# EAGLE design ZMinusSunSensorBoard (EAGLE 9.6.2)
DESIGNER: T. Christison; REV#: A

## Sheet 1 of 5
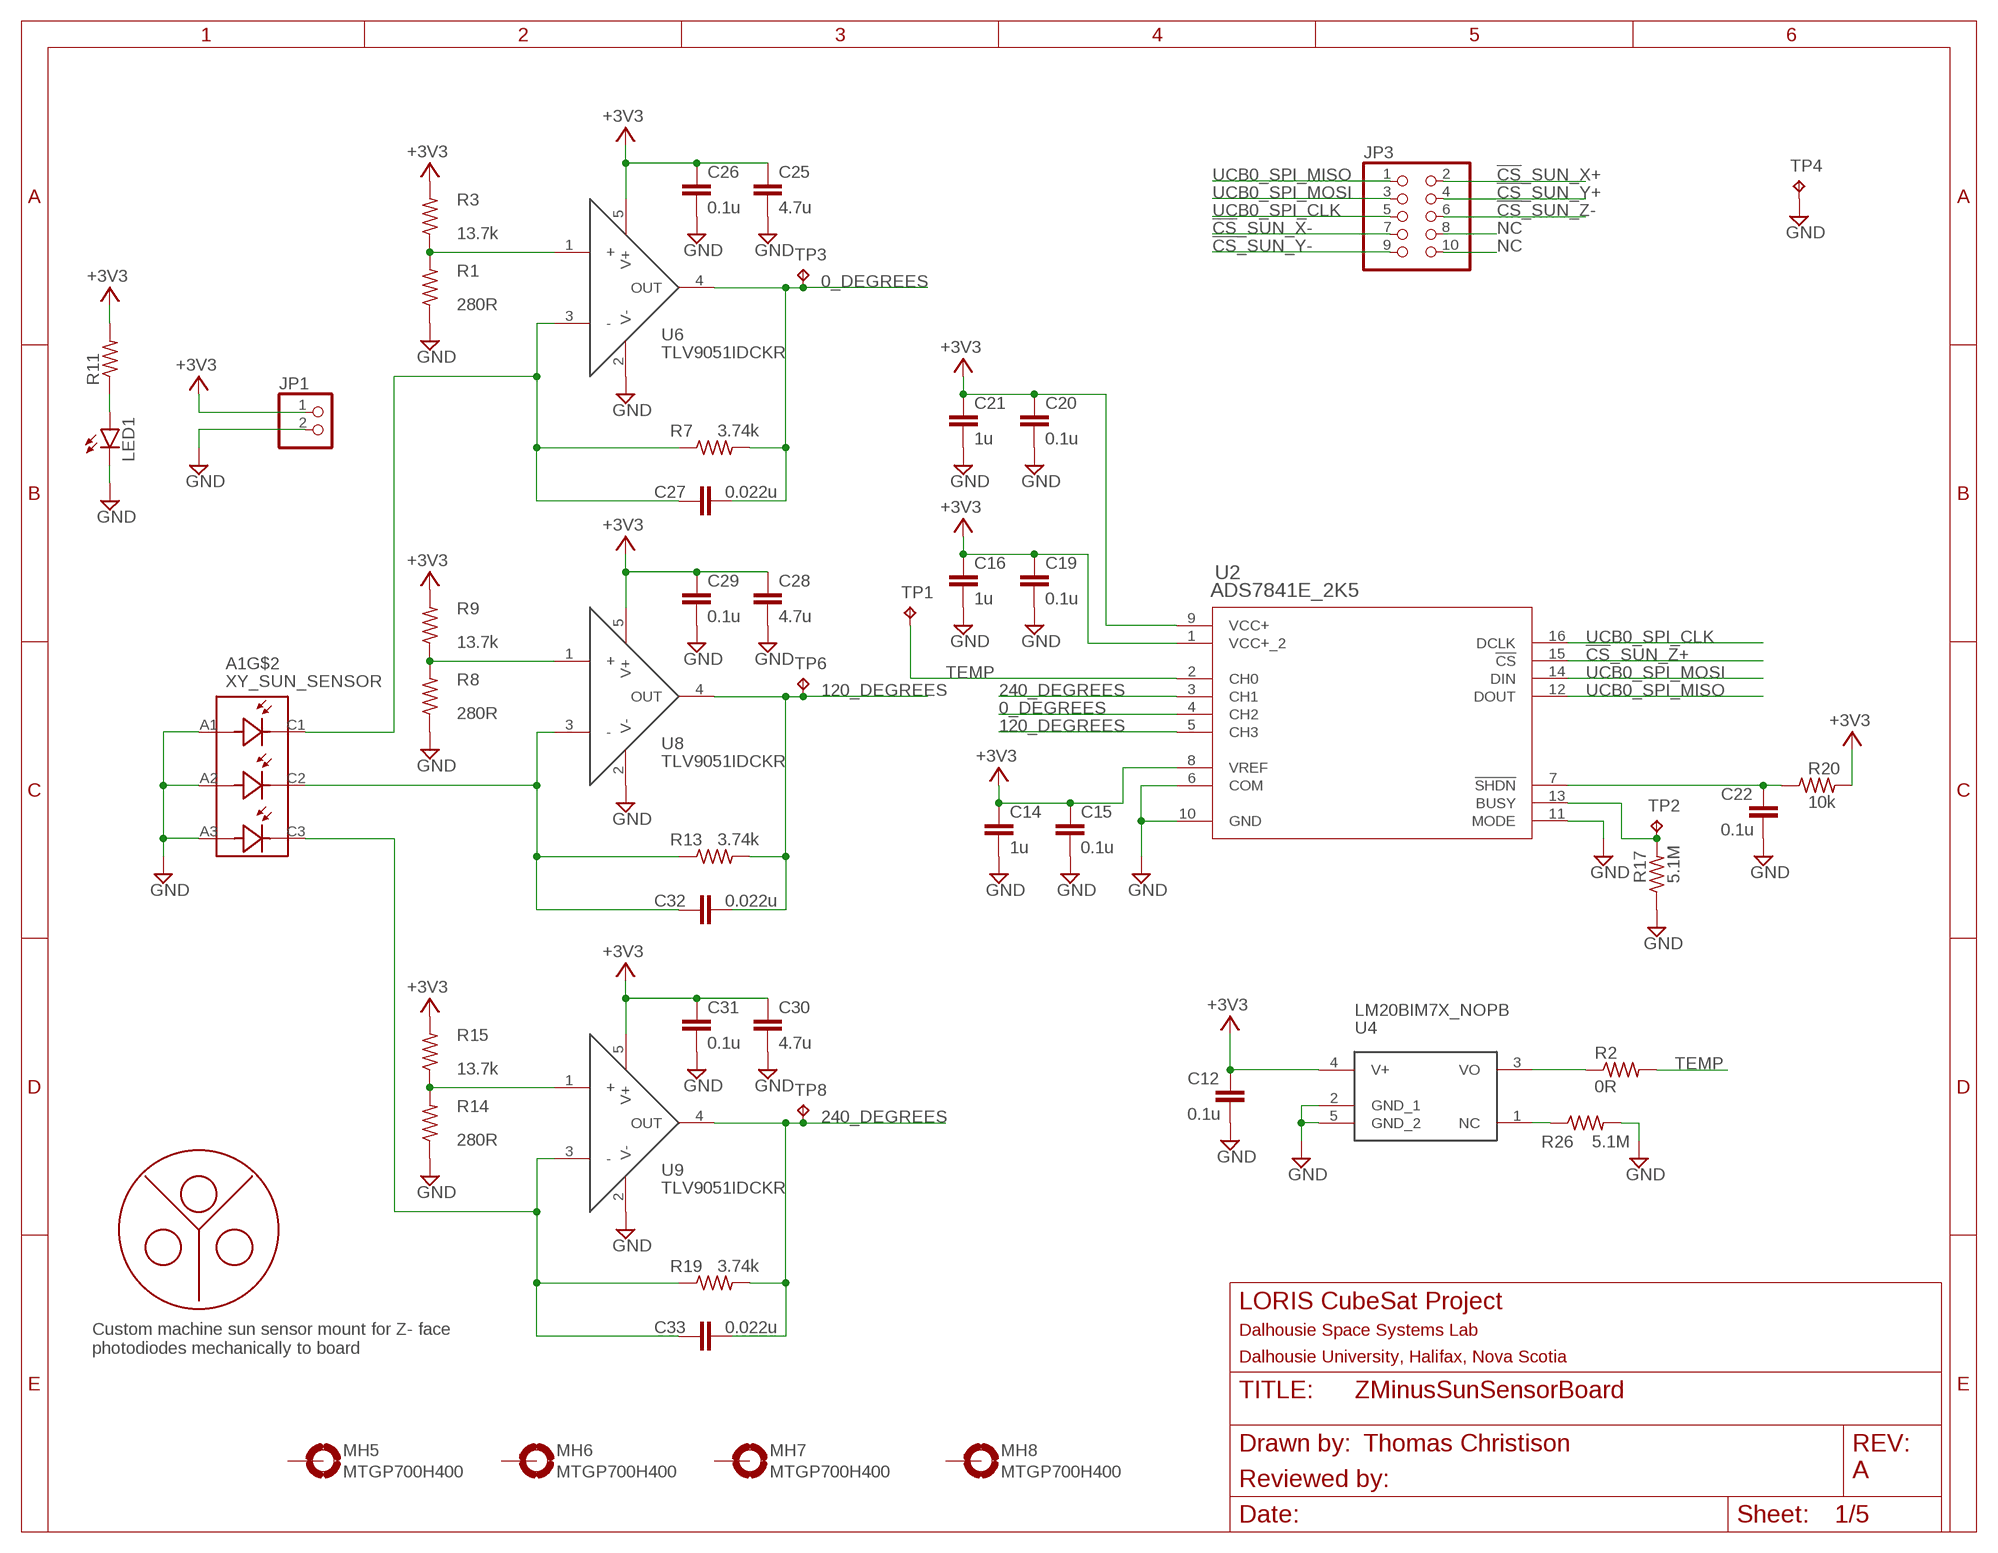
[diagram p0: schematic, sheet 1]

### Parts
A1  XY_SUN_SENSOR  [XY_SUN_SENOR_MASK]
C12  0.1u  C-EUC0402  [C0402]
C14  1u  C-EUC0402  [C0402]
C15  0.1u  C-EUC0402  [C0402]
C16  1u  C-EUC0402  [C0402]
C19  0.1u  C-EUC0402  [C0402]
C20  0.1u  C-EUC0402  [C0402]
C21  1u  C-EUC0402  [C0402]
C22  0.1u  C-EUC0402  [C0402]
C25  4.7u  C-EUC0805  [C0805]
C26  0.1u  C-EUC0402  [C0402]
C27  0.022u  C-EUC0402  [C0402]
C28  4.7u  C-EUC0805  [C0805]
C29  0.1u  C-EUC0402  [C0402]
C30  4.7u  C-EUC0805  [C0805]
C31  0.1u  C-EUC0402  [C0402]
C32  0.022u  C-EUC0402  [C0402]
C33  0.022u  C-EUC0402  [C0402]
JP1  PINHD-1X2  [1X02]
JP3  PINHD-2X5  [2X05]
LED1  LEDCHIP-LED0603  [CHIP-LED0603]
MH5  MTGP700H400  [MTGP700H400]
MH6  MTGP700H400  [MTGP700H400]
MH7  MTGP700H400  [MTGP700H400]
MH8  MTGP700H400  [MTGP700H400]
R1  280R  R-US_R0402  [R0402]
R2  0R  R-US_R0805  [R0805]
R3  13.7k  R-US_R0402  [R0402]
R7  3.74k  R-US_R0402  [R0402]
R8  280R  R-US_R0402  [R0402]
R9  13.7k  R-US_R0402  [R0402]
R11  R-US_R0603  [R0603]
R13  3.74k  R-US_R0402  [R0402]
R14  280R  R-US_R0402  [R0402]
R15  13.7k  R-US_R0402  [R0402]
R17  5.1M  R-US_R0402  [R0402]
R19  3.74k  R-US_R0402  [R0402]
R20  10k  R-US_R0402  [R0402]
R26  5.1M  R-US_R0402  [R0402]
TP1  TESTPOINT  [TP_P76H50]
TP2  TESTPOINT  [TP_P76H50]
TP3  TESTPOINT  [TP_P76H50]
TP4  TESTPOINT  [TP_P76H50]
TP6  TESTPOINT  [TP_P76H50]
TP8  TESTPOINT  [TP_P76H50]
U2  ADS7841E_2K5  [DBQ16]
U4  LM20BIM7X_NOPB  [SOT23-5P65_210X110L40X22N_LM20]
U6  TLV9051IDCKR  [SC70-5P65_210X110L36X22N_TLV9051]
U8  TLV9051IDCKR  [SC70-5P65_210X110L36X22N_TLV9051]
U9  TLV9051IDCKR  [SC70-5P65_210X110L36X22N_TLV9051]

### Nets
0_DEGREES: C27.2 R7.2 TP3.1(TP) U2.4(CH2) U6.4(OUT)
120_DEGREES: C32.2 R13.2 TP6.1(TP) U2.5(CH3) U8.4(OUT)
240_DEGREES: C33.2 R19.2 TP8.1(TP) U2.3(CH1) U9.4(OUT)
!CS!_SUN_X+: JP3.2 ; also sheet 2
!CS!_SUN_X-: JP3.7 ; also sheet 3
!CS!_SUN_Y+: JP3.4 ; also sheet 4
!CS!_SUN_Y-: JP3.9 ; also sheet 5
!CS!_SUN_Z+: U2.15(!CS)
!CS!_SUN_Z-: JP3.6
+3V3: C12.1 C14.1 C15.1 C16.1 C19.1 C20.1 C21.1 C25.1 C26.1 C28.1 C29.1 C30.1 C31.1 JP1.1 R3.2 R9.2 R11.2 R15.2 R20.2 U2.1(VCC+_2) U2.8(VREF) U2.9(VCC+) U4.4(V+) U6.5(V+) U8.5(V+) U9.5(V+) ; also sheet 2,3,4,5
GND: A1.A1 A1.A2 A1.A3 C12.2 C14.2 C15.2 C16.2 C19.2 C20.2 C21.2 C22.2 C25.2 C26.2 C28.2 C29.2 C30.2 C31.2 JP1.2 LED1.C R1.1 R8.1 R14.1 R17.1 R26.2 TP4.1(TP) U2.6(COM) U2.10(GND) U2.11(MODE) U4.2(GND_1) U4.5(GND_2) U6.2(V-) U8.2(V-) U9.2(V-) ; also sheet 2,3,4,5
N$1: R2.1 U4.3(VO)
N$2: R17.2 TP2.1(TP) U2.13(BUSY)
N$3: A1.C1 C27.1 R7.1 U6.3(-)
N$6: R1.2 R3.1 U6.1(+)
N$7: R26.1 U4.1(NC)
N$8: A1.C2 C32.1 R13.1 U8.3(-)
N$9: R8.2 R9.1 U8.1(+)
N$12: A1.C3 C33.1 R19.1 U9.3(-)
N$13: R14.2 R15.1 U9.1(+)
N$15: C22.1 R20.1 U2.7(!SHDN)
N$48: LED1.A R11.1
N$67: JP3.8
N$68: JP3.10
TEMP: R2.2 TP1.1(TP) U2.2(CH0)
UCB0_SPI_CLK: JP3.5 U2.16(DCLK) ; also sheet 2,3,4,5
UCB0_SPI_MISO: JP3.1 U2.12(DOUT) ; also sheet 2,3,4,5
UCB0_SPI_MOSI: JP3.3 U2.14(DIN) ; also sheet 2,3,4,5
Unconnected: MH5.1(MOUNT) MH6.1(MOUNT) MH7.1(MOUNT) MH8.1(MOUNT)

### Notes on the sheet
- NC
- NC
- Custom machine sun sensor mount for Z- face
  photodiodes mechanically to board
- Thomas Christison
- A

## Sheet 2 of 5
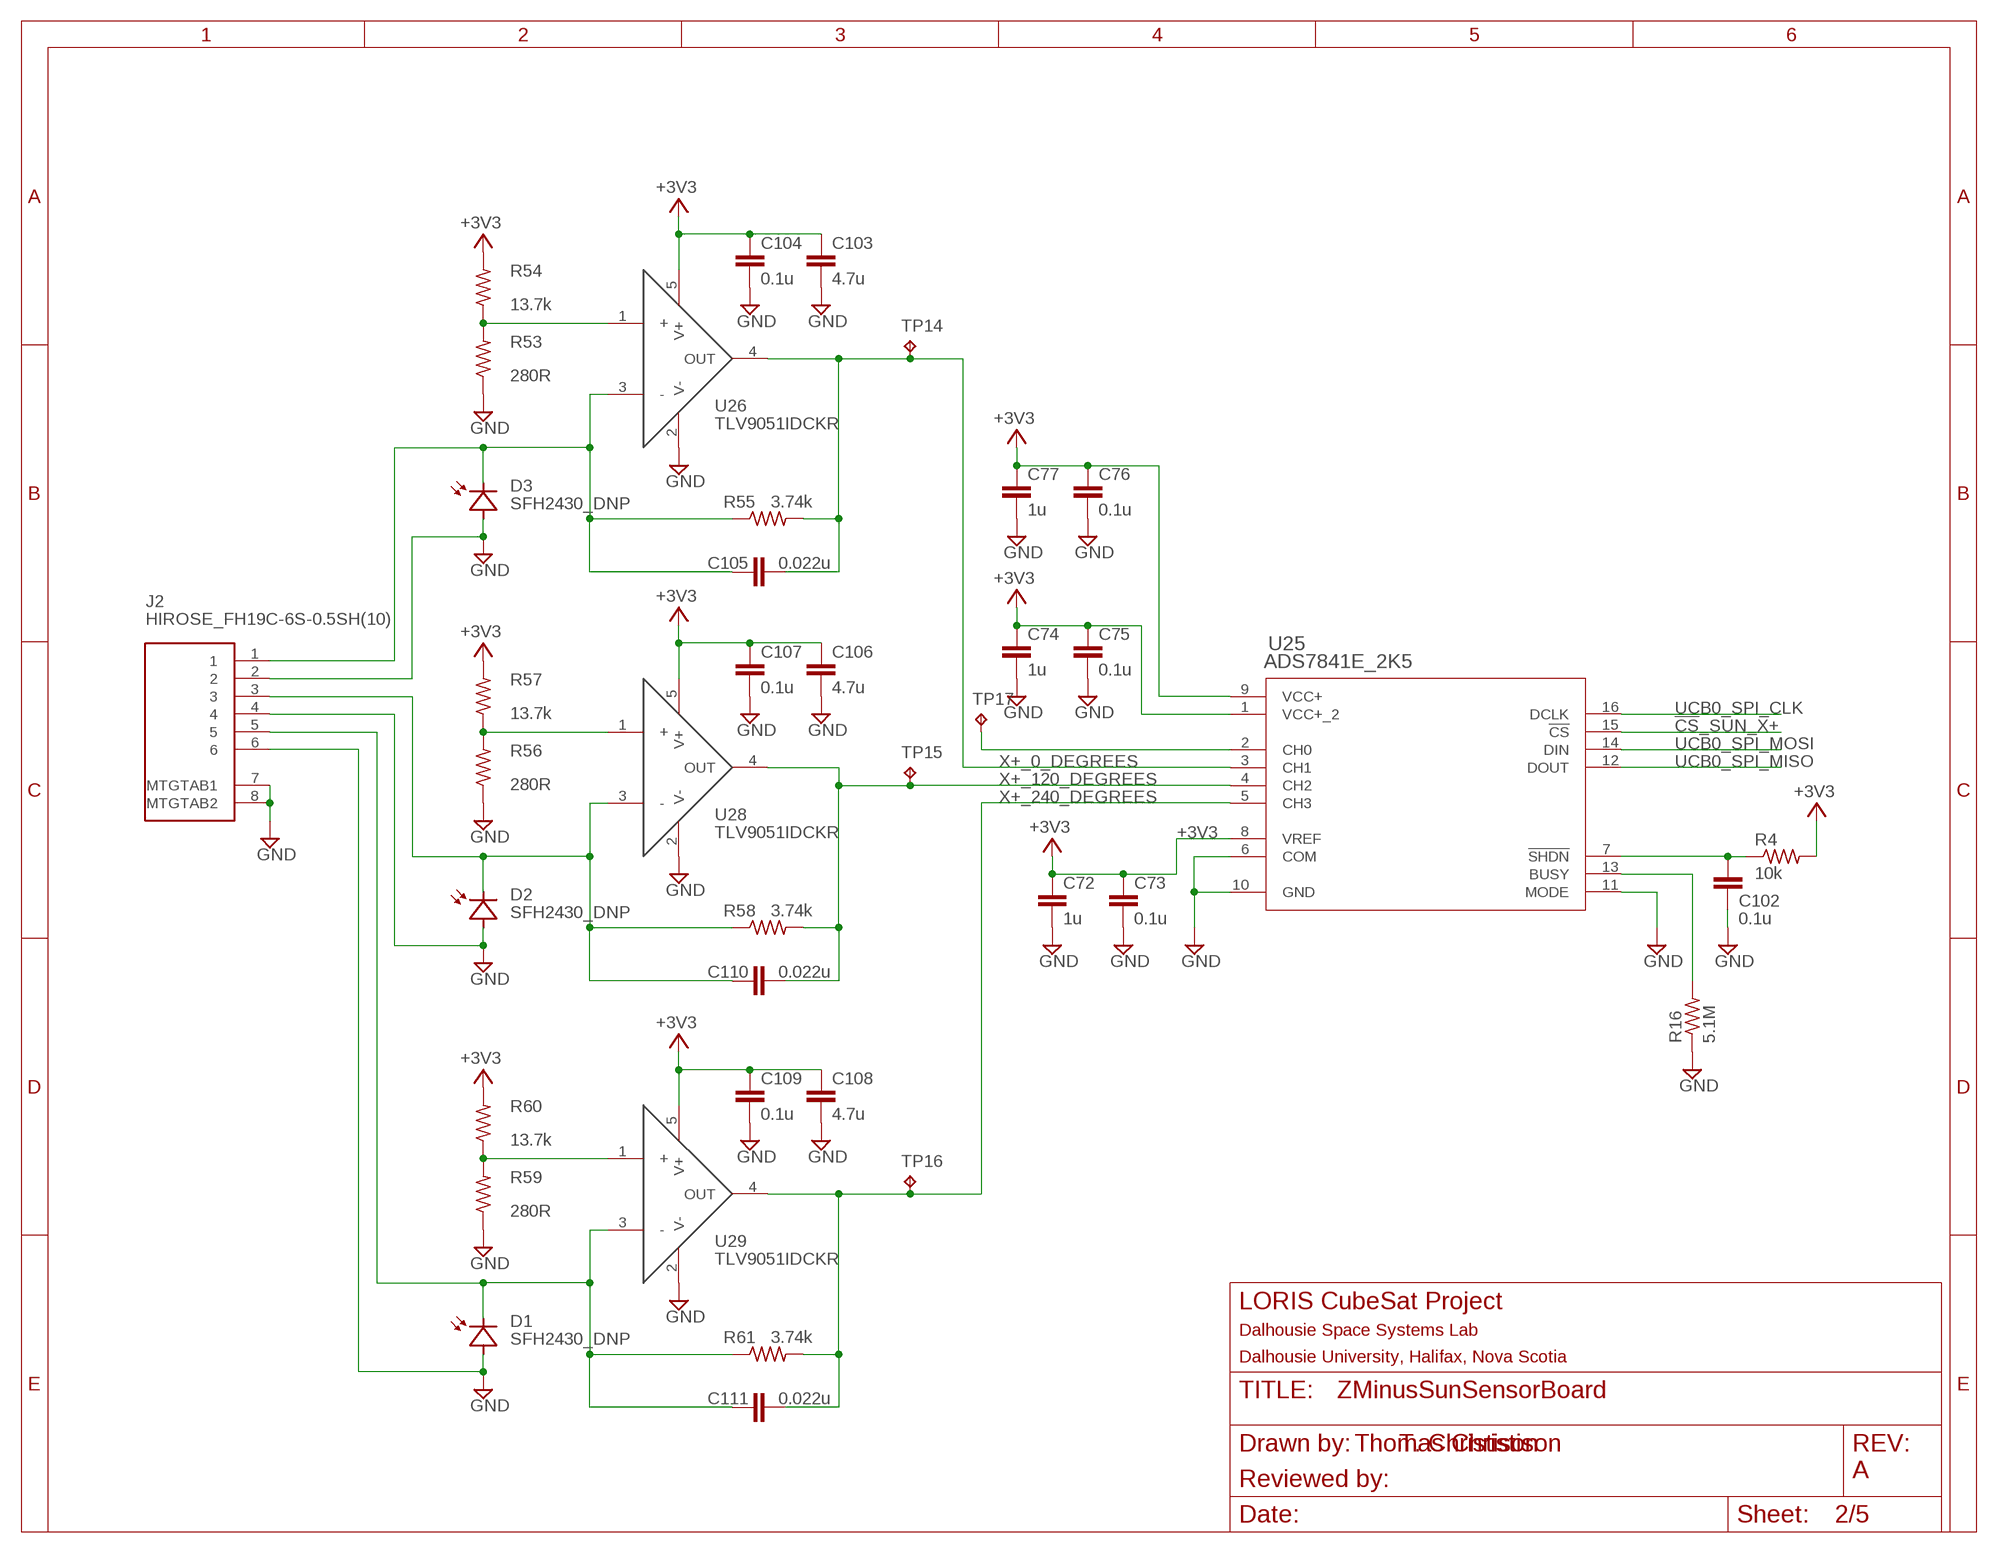
[diagram p1: schematic, sheet 2]

### Parts
C72  1u  C-EUC0402  [C0402]
C73  0.1u  C-EUC0402  [C0402]
C74  1u  C-EUC0402  [C0402]
C75  0.1u  C-EUC0402  [C0402]
C76  0.1u  C-EUC0402  [C0402]
C77  1u  C-EUC0402  [C0402]
C102  0.1u  C-EUC0402  [C0402]
C103  4.7u  C-EUC0402  [C0402]
C104  0.1u  C-EUC0402  [C0402]
C105  0.022u  C-EUC0402  [C0402]
C106  4.7u  C-EUC0402  [C0402]
C107  0.1u  C-EUC0402  [C0402]
C108  4.7u  C-EUC0402  [C0402]
C109  0.1u  C-EUC0402  [C0402]
C110  0.022u  C-EUC0402  [C0402]
C111  0.022u  C-EUC0402  [C0402]
J2  HIROSE_FH19C-6S-0.5SH(10)  [HIROSE_FH19C-6S-0.5SH(10)]
R4  10k  R-US_R0402  [R0402]
R16  5.1M  R-US_R0402  [R0402]
R53  280R  R-US_R0402  [R0402]
R54  13.7k  R-US_R0402  [R0402]
R55  3.74k  R-US_R0402  [R0402]
R56  280R  R-US_R0402  [R0402]
R57  13.7k  R-US_R0402  [R0402]
R58  3.74k  R-US_R0402  [R0402]
R59  280R  R-US_R0402  [R0402]
R60  13.7k  R-US_R0402  [R0402]
R61  3.74k  R-US_R0402  [R0402]
TP14  TESTPOINT  [TP_P76H50]
TP15  TESTPOINT  [TP_P76H50]
TP16  TESTPOINT  [TP_P76H50]
TP17  TESTPOINT  [TP_P76H50]
U25  ADS7841E_2K5  [DBQ16]
U26  TLV9051IDCKR  [SC70-5P65_210X110L36X22N_TLV9051]
U28  TLV9051IDCKR  [SC70-5P65_210X110L36X22N_TLV9051]
U29  TLV9051IDCKR  [SC70-5P65_210X110L36X22N_TLV9051]

### Nets
!CS!_SUN_X+: U25.15(!CS) ; also sheet 1
+3V3: C72.1 C73.1 C74.1 C75.1 C76.1 C77.1 C103.1 C104.1 C106.1 C107.1 C108.1 C109.1 R4.2 R54.2 R57.2 R60.2 U25.1(VCC+_2) U25.8(VREF) U25.9(VCC+) U26.5(V+) U28.5(V+) U29.5(V+) ; also sheet 1,3,4,5
GND: C72.2 C73.2 C74.2 C75.2 C76.2 C77.2 C102.2 C103.2 C104.2 C106.2 C107.2 C108.2 C109.2 J2.2 J2.4 J2.6 J2.7(MTGTAB1) J2.8(MTGTAB2) R16.1 R53.1 R56.1 R59.1 U25.6(COM) U25.10(GND) U25.11(MODE) U26.2(V-) U28.2(V-) U29.2(V-) ; also sheet 1,3,4,5
N$4: C102.1 R4.1 U25.7(!SHDN)
N$5: TP17.1(TP) U25.2(CH0)
N$49: C105.1 J2.1 R55.1 U26.3(-)
N$51: R16.2 U25.13(BUSY)
N$54: R53.2 R54.1 U26.1(+)
N$55: C110.1 J2.3 R58.1 U28.3(-)
N$56: R56.2 R57.1 U28.1(+)
N$57: C111.1 J2.5 R61.1 U29.3(-)
N$58: R59.2 R60.1 U29.1(+)
UCB0_SPI_CLK: U25.16(DCLK) ; also sheet 1,3,4,5
UCB0_SPI_MISO: U25.12(DOUT) ; also sheet 1,3,4,5
UCB0_SPI_MOSI: U25.14(DIN) ; also sheet 1,3,4,5
X+_0_DEGREES: C105.2 R55.2 TP14.1(TP) U25.3(CH1) U26.4(OUT)
X+_120_DEGREES: C110.2 R58.2 TP15.1(TP) U25.4(CH2) U28.4(OUT)
X+_240_DEGREES: C111.2 R61.2 TP16.1(TP) U25.5(CH3) U29.4(OUT)

### Notes on the sheet
- Thomas Christison
- A

## Sheet 3 of 5
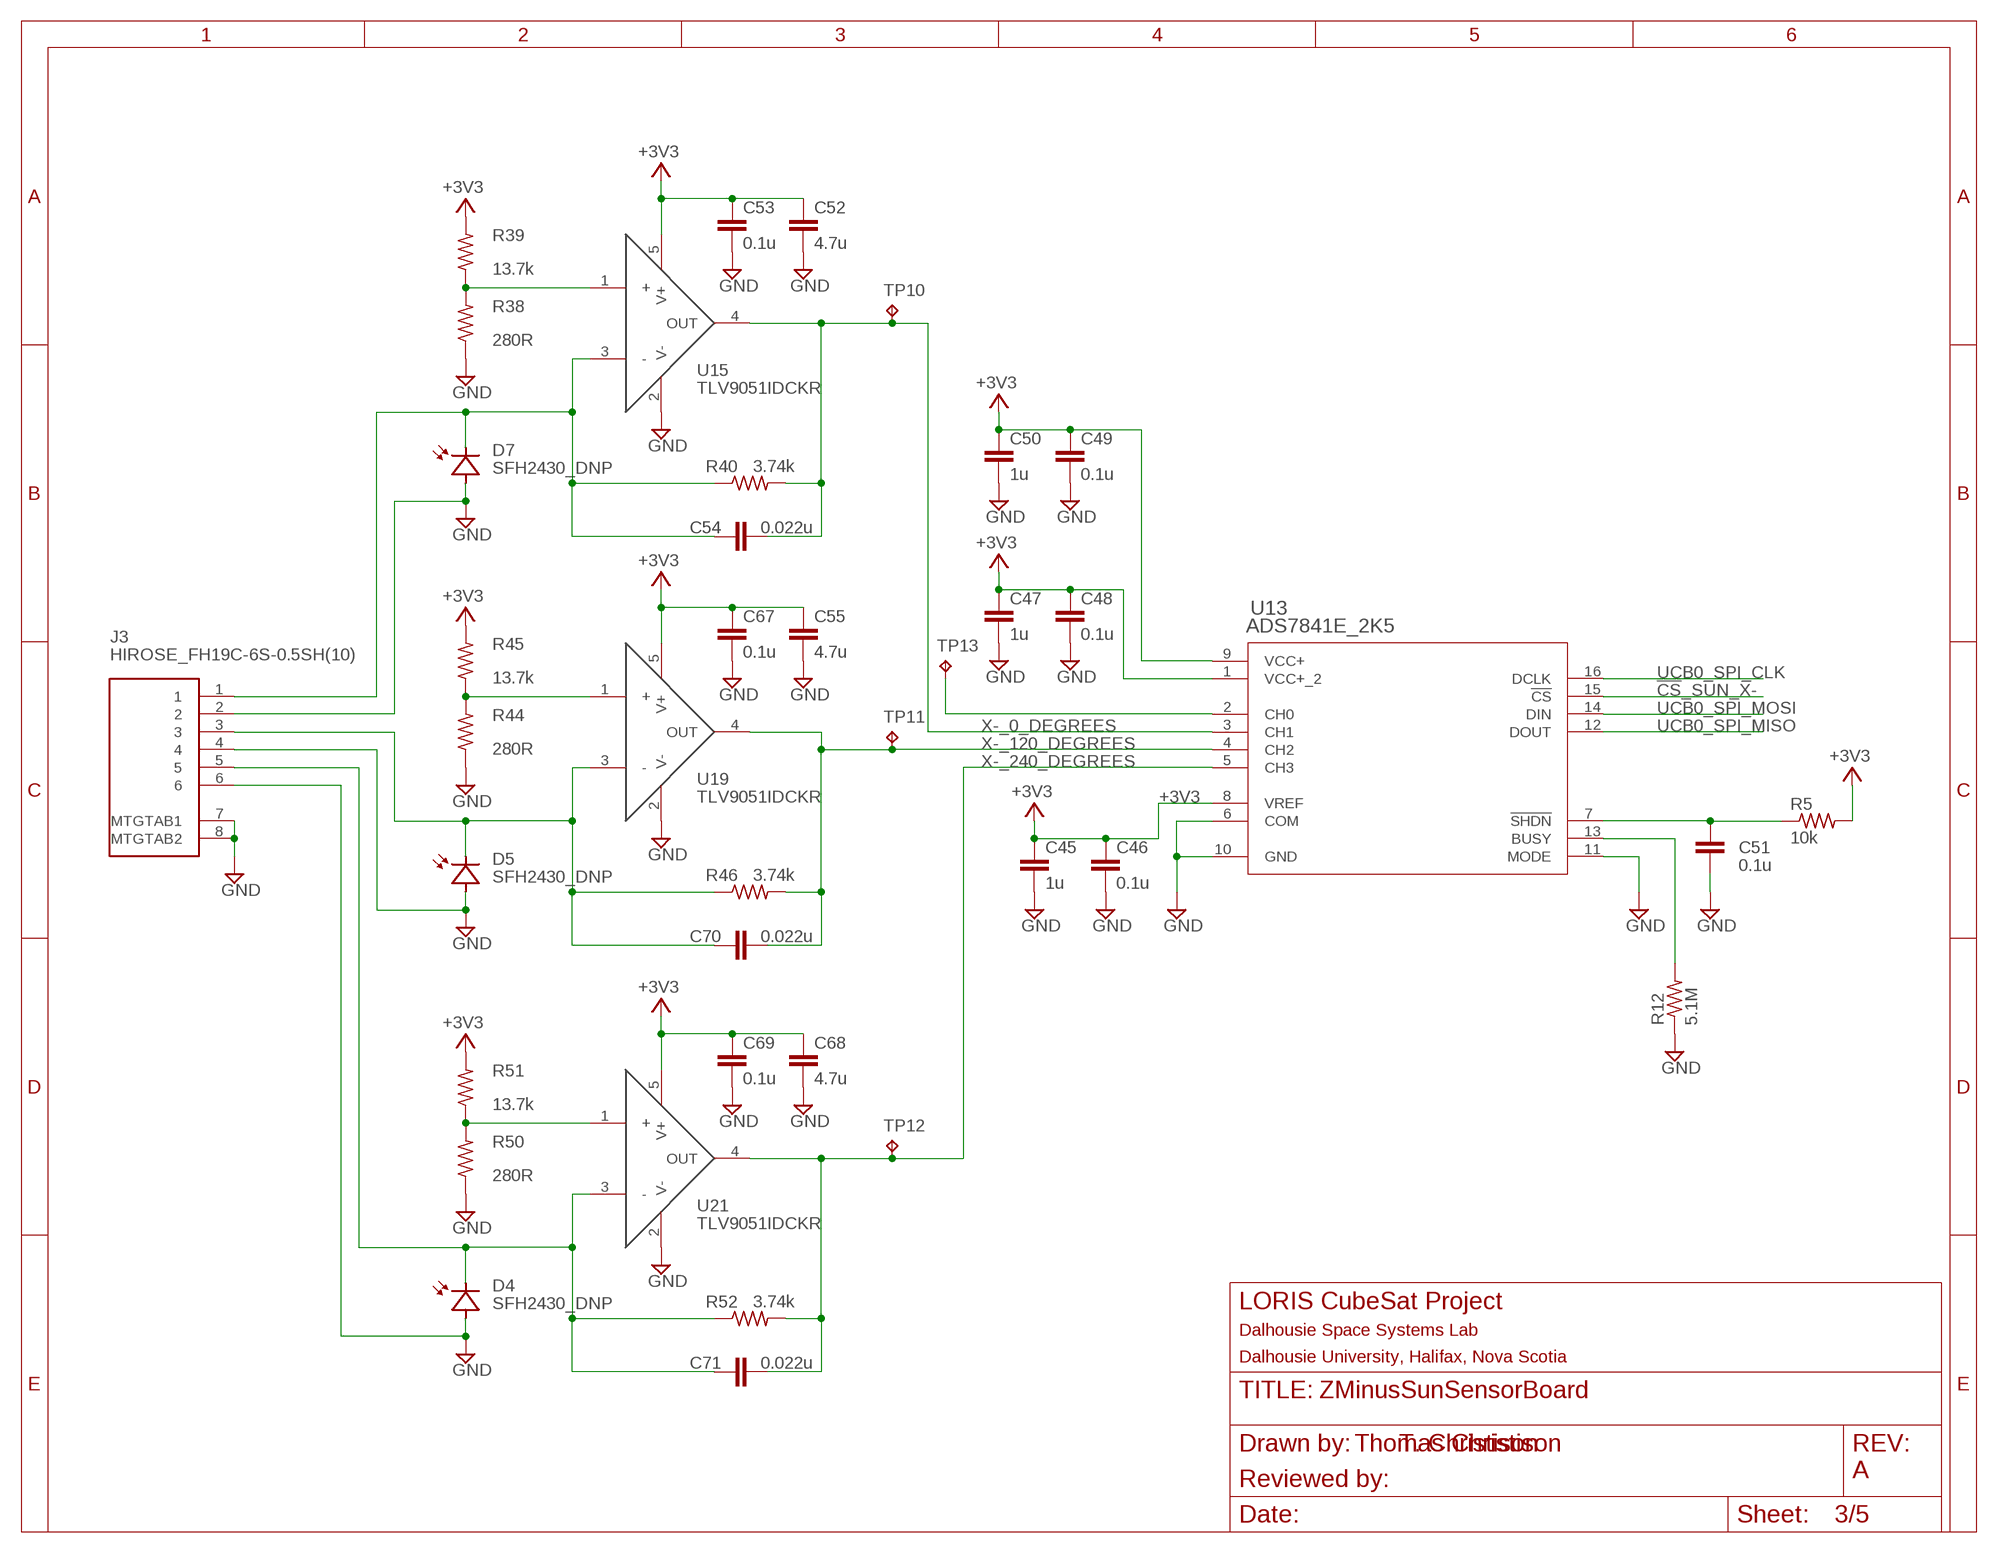
[diagram p2: schematic, sheet 3]

### Parts
C45  1u  C-EUC0402  [C0402]
C46  0.1u  C-EUC0402  [C0402]
C47  1u  C-EUC0402  [C0402]
C48  0.1u  C-EUC0402  [C0402]
C49  0.1u  C-EUC0402  [C0402]
C50  1u  C-EUC0402  [C0402]
C51  0.1u  C-EUC0402  [C0402]
C52  4.7u  C-EUC0402  [C0402]
C53  0.1u  C-EUC0402  [C0402]
C54  0.022u  C-EUC0402  [C0402]
C55  4.7u  C-EUC0402  [C0402]
C67  0.1u  C-EUC0402  [C0402]
C68  4.7u  C-EUC0402  [C0402]
C69  0.1u  C-EUC0402  [C0402]
C70  0.022u  C-EUC0402  [C0402]
C71  0.022u  C-EUC0402  [C0402]
J3  HIROSE_FH19C-6S-0.5SH(10)  [HIROSE_FH19C-6S-0.5SH(10)]
R5  10k  R-US_R0402  [R0402]
R12  5.1M  R-US_R0402  [R0402]
R38  280R  R-US_R0402  [R0402]
R39  13.7k  R-US_R0402  [R0402]
R40  3.74k  R-US_R0402  [R0402]
R44  280R  R-US_R0402  [R0402]
R45  13.7k  R-US_R0402  [R0402]
R46  3.74k  R-US_R0402  [R0402]
R50  280R  R-US_R0402  [R0402]
R51  13.7k  R-US_R0402  [R0402]
R52  3.74k  R-US_R0402  [R0402]
TP10  TESTPOINT  [TP_P76H50]
TP11  TESTPOINT  [TP_P76H50]
TP12  TESTPOINT  [TP_P76H50]
TP13  TESTPOINT  [TP_P76H50]
U13  ADS7841E_2K5  [DBQ16]
U15  TLV9051IDCKR  [SC70-5P65_210X110L36X22N_TLV9051]
U19  TLV9051IDCKR  [SC70-5P65_210X110L36X22N_TLV9051]
U21  TLV9051IDCKR  [SC70-5P65_210X110L36X22N_TLV9051]

### Nets
!CS!_SUN_X-: U13.15(!CS) ; also sheet 1
+3V3: C45.1 C46.1 C47.1 C48.1 C49.1 C50.1 C52.1 C53.1 C55.1 C67.1 C68.1 C69.1 R5.2 R39.2 R45.2 R51.2 U13.1(VCC+_2) U13.8(VREF) U13.9(VCC+) U15.5(V+) U19.5(V+) U21.5(V+) ; also sheet 1,2,4,5
GND: C45.2 C46.2 C47.2 C48.2 C49.2 C50.2 C51.2 C52.2 C53.2 C55.2 C67.2 C68.2 C69.2 J3.2 J3.4 J3.6 J3.7(MTGTAB1) J3.8(MTGTAB2) R12.1 R38.1 R44.1 R50.1 U13.6(COM) U13.10(GND) U13.11(MODE) U15.2(V-) U19.2(V-) U21.2(V-) ; also sheet 1,2,4,5
N$10: TP13.1(TP) U13.2(CH0)
N$22: C51.1 R5.1 U13.7(!SHDN)
N$38: C54.1 J3.1 R40.1 U15.3(-)
N$41: R38.2 R39.1 U15.1(+)
N$44: C70.1 J3.3 R46.1 U19.3(-)
N$45: R44.2 R45.1 U19.1(+)
N$46: C71.1 J3.5 R52.1 U21.3(-)
N$47: R50.2 R51.1 U21.1(+)
N$50: R12.2 U13.13(BUSY)
UCB0_SPI_CLK: U13.16(DCLK) ; also sheet 1,2,4,5
UCB0_SPI_MISO: U13.12(DOUT) ; also sheet 1,2,4,5
UCB0_SPI_MOSI: U13.14(DIN) ; also sheet 1,2,4,5
X-_0_DEGREES: C54.2 R40.2 TP10.1(TP) U13.3(CH1) U15.4(OUT)
X-_120_DEGREES: C70.2 R46.2 TP11.1(TP) U13.4(CH2) U19.4(OUT)
X-_240_DEGREES: C71.2 R52.2 TP12.1(TP) U13.5(CH3) U21.4(OUT)

### Notes on the sheet
- Thomas Christison
- A

## Sheet 4 of 5
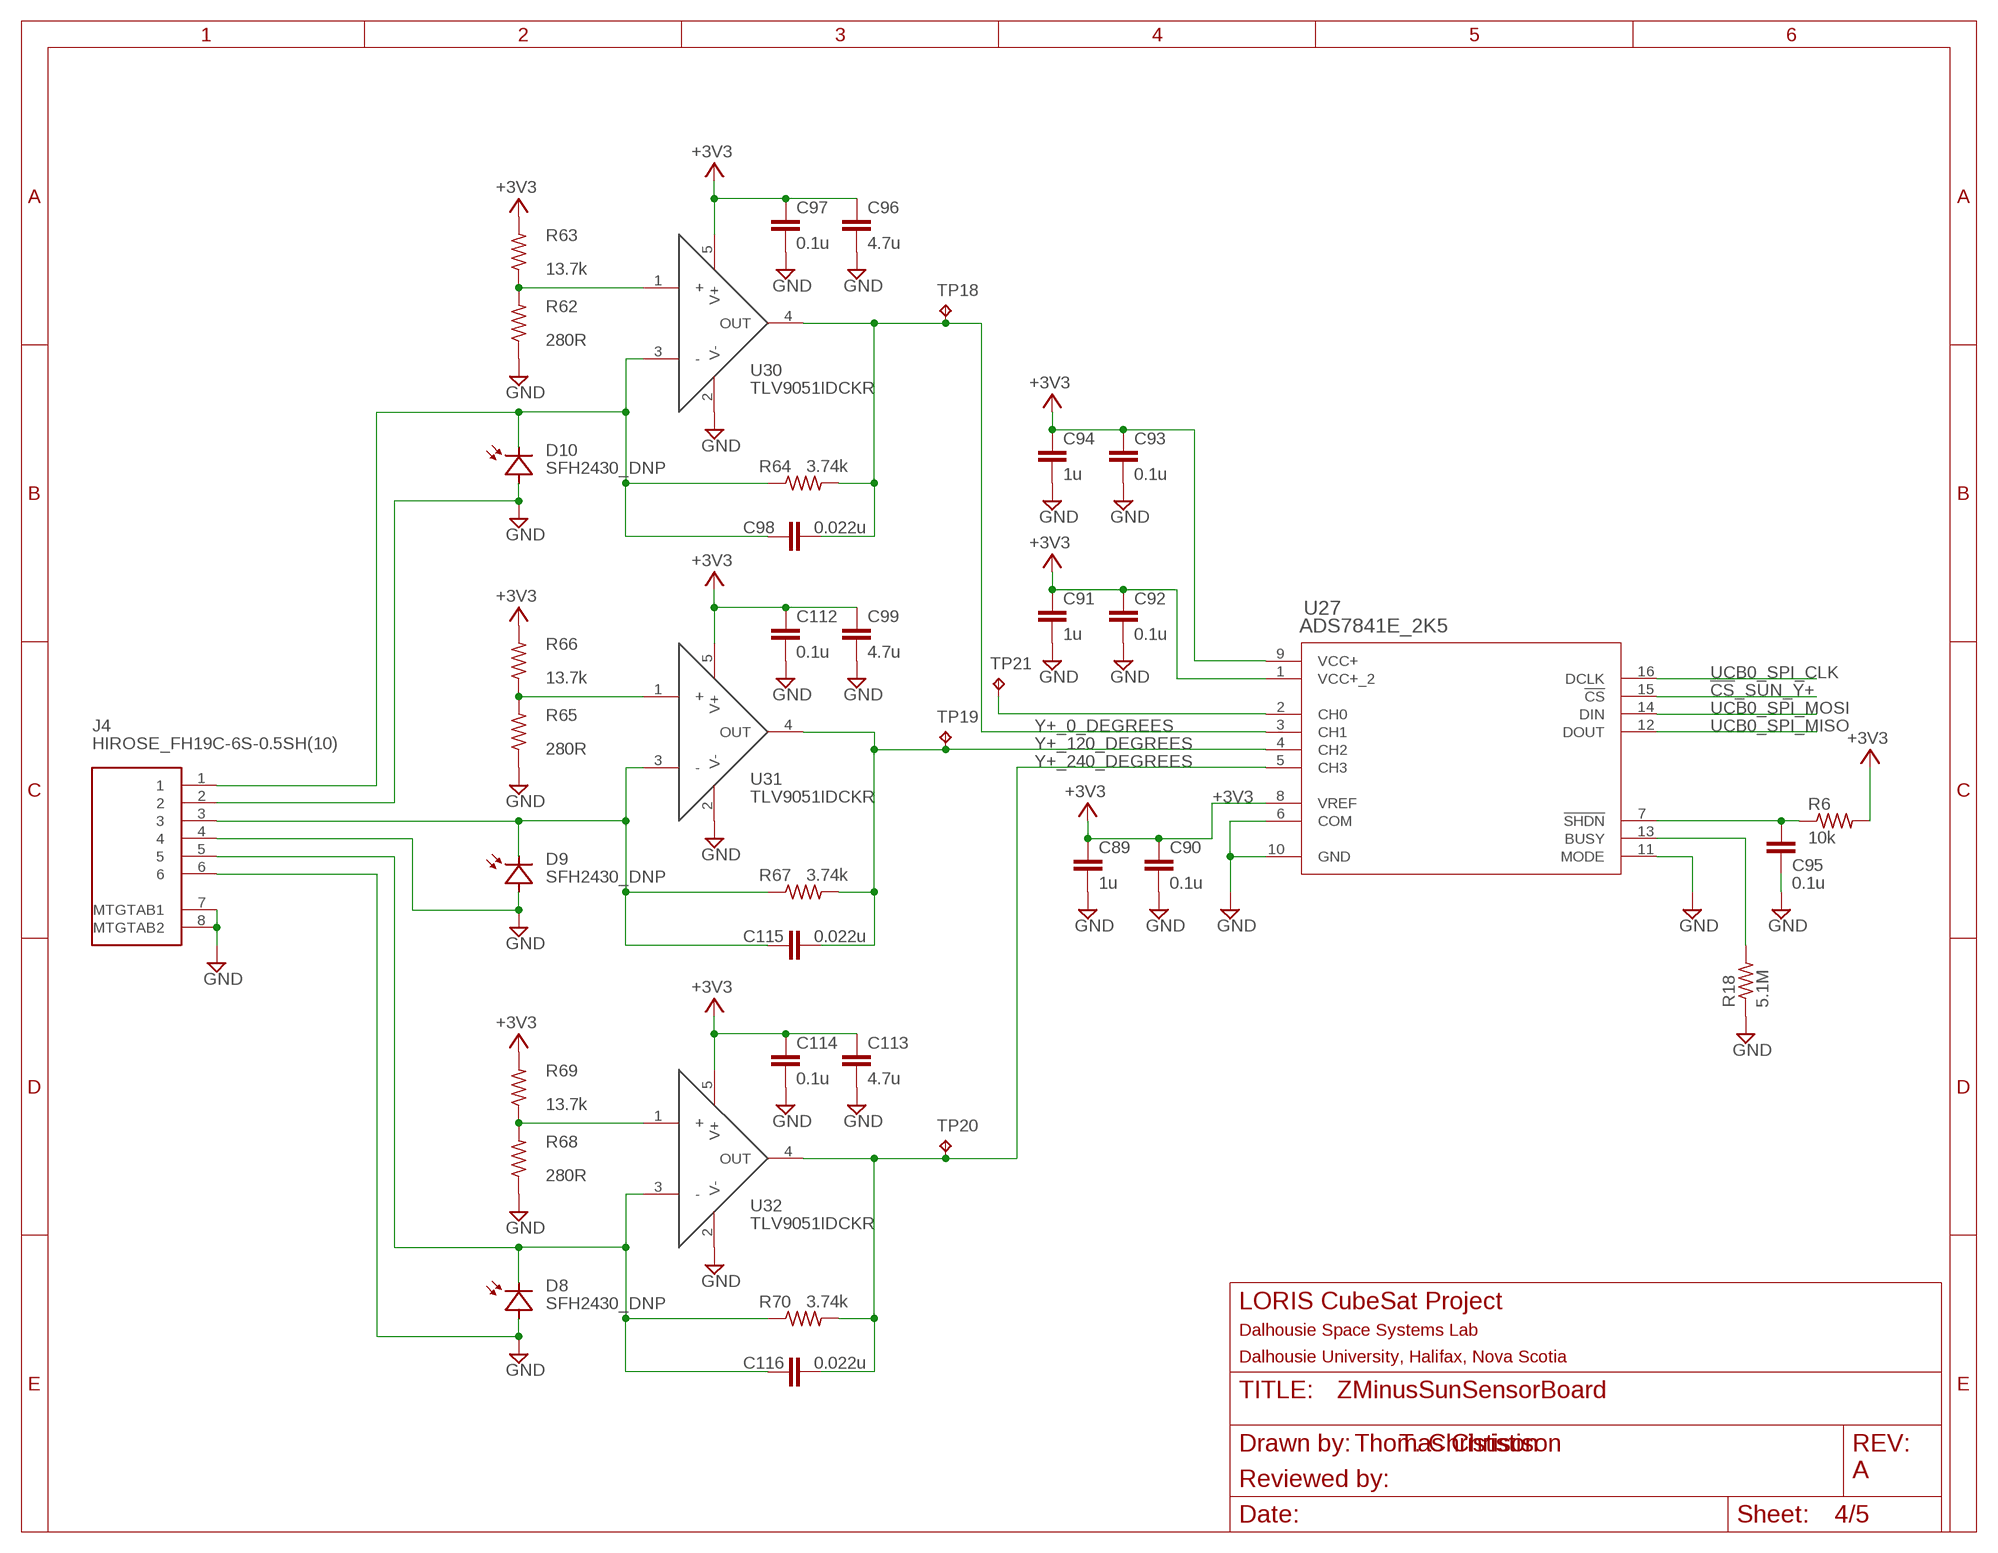
[diagram p3: schematic, sheet 4]

### Parts
C89  1u  C-EUC0402  [C0402]
C90  0.1u  C-EUC0402  [C0402]
C91  1u  C-EUC0402  [C0402]
C92  0.1u  C-EUC0402  [C0402]
C93  0.1u  C-EUC0402  [C0402]
C94  1u  C-EUC0402  [C0402]
C95  0.1u  C-EUC0402  [C0402]
C96  4.7u  C-EUC0402  [C0402]
C97  0.1u  C-EUC0402  [C0402]
C98  0.022u  C-EUC0402  [C0402]
C99  4.7u  C-EUC0402  [C0402]
C112  0.1u  C-EUC0402  [C0402]
C113  4.7u  C-EUC0402  [C0402]
C114  0.1u  C-EUC0402  [C0402]
C115  0.022u  C-EUC0402  [C0402]
C116  0.022u  C-EUC0402  [C0402]
J4  HIROSE_FH19C-6S-0.5SH(10)  [HIROSE_FH19C-6S-0.5SH(10)]
R6  10k  R-US_R0402  [R0402]
R18  5.1M  R-US_R0402  [R0402]
R62  280R  R-US_R0402  [R0402]
R63  13.7k  R-US_R0402  [R0402]
R64  3.74k  R-US_R0402  [R0402]
R65  280R  R-US_R0402  [R0402]
R66  13.7k  R-US_R0402  [R0402]
R67  3.74k  R-US_R0402  [R0402]
R68  280R  R-US_R0402  [R0402]
R69  13.7k  R-US_R0402  [R0402]
R70  3.74k  R-US_R0402  [R0402]
TP18  TESTPOINT  [TP_P76H50]
TP19  TESTPOINT  [TP_P76H50]
TP20  TESTPOINT  [TP_P76H50]
TP21  TESTPOINT  [TP_P76H50]
U27  ADS7841E_2K5  [DBQ16]
U30  TLV9051IDCKR  [SC70-5P65_210X110L36X22N_TLV9051]
U31  TLV9051IDCKR  [SC70-5P65_210X110L36X22N_TLV9051]
U32  TLV9051IDCKR  [SC70-5P65_210X110L36X22N_TLV9051]

### Nets
!CS!_SUN_Y+: U27.15(!CS) ; also sheet 1
+3V3: C89.1 C90.1 C91.1 C92.1 C93.1 C94.1 C96.1 C97.1 C99.1 C112.1 C113.1 C114.1 R6.2 R63.2 R66.2 R69.2 U27.1(VCC+_2) U27.8(VREF) U27.9(VCC+) U30.5(V+) U31.5(V+) U32.5(V+) ; also sheet 1,2,3,5
GND: C89.2 C90.2 C91.2 C92.2 C93.2 C94.2 C95.2 C96.2 C97.2 C99.2 C112.2 C113.2 C114.2 J4.2 J4.4 J4.6 J4.7(MTGTAB1) J4.8(MTGTAB2) R18.1 R62.1 R65.1 R68.1 U27.6(COM) U27.10(GND) U27.11(MODE) U30.2(V-) U31.2(V-) U32.2(V-) ; also sheet 1,2,3,5
N$11: TP21.1(TP) U27.2(CH0)
N$25: C95.1 R6.1 U27.7(!SHDN)
N$37: C98.1 J4.1 R64.1 U30.3(-)
N$52: R18.2 U27.13(BUSY)
N$61: R62.2 R63.1 U30.1(+)
N$63: C115.1 J4.3 R67.1 U31.3(-)
N$64: R65.2 R66.1 U31.1(+)
N$65: C116.1 J4.5 R70.1 U32.3(-)
N$66: R68.2 R69.1 U32.1(+)
UCB0_SPI_CLK: U27.16(DCLK) ; also sheet 1,2,3,5
UCB0_SPI_MISO: U27.12(DOUT) ; also sheet 1,2,3,5
UCB0_SPI_MOSI: U27.14(DIN) ; also sheet 1,2,3,5
Y+_0_DEGREES: C98.2 R64.2 TP18.1(TP) U27.3(CH1) U30.4(OUT)
Y+_120_DEGREES: C115.2 R67.2 TP19.1(TP) U27.4(CH2) U31.4(OUT)
Y+_240_DEGREES: C116.2 R70.2 TP20.1(TP) U27.5(CH3) U32.4(OUT)

### Notes on the sheet
- Thomas Christison
- A

## Sheet 5 of 5
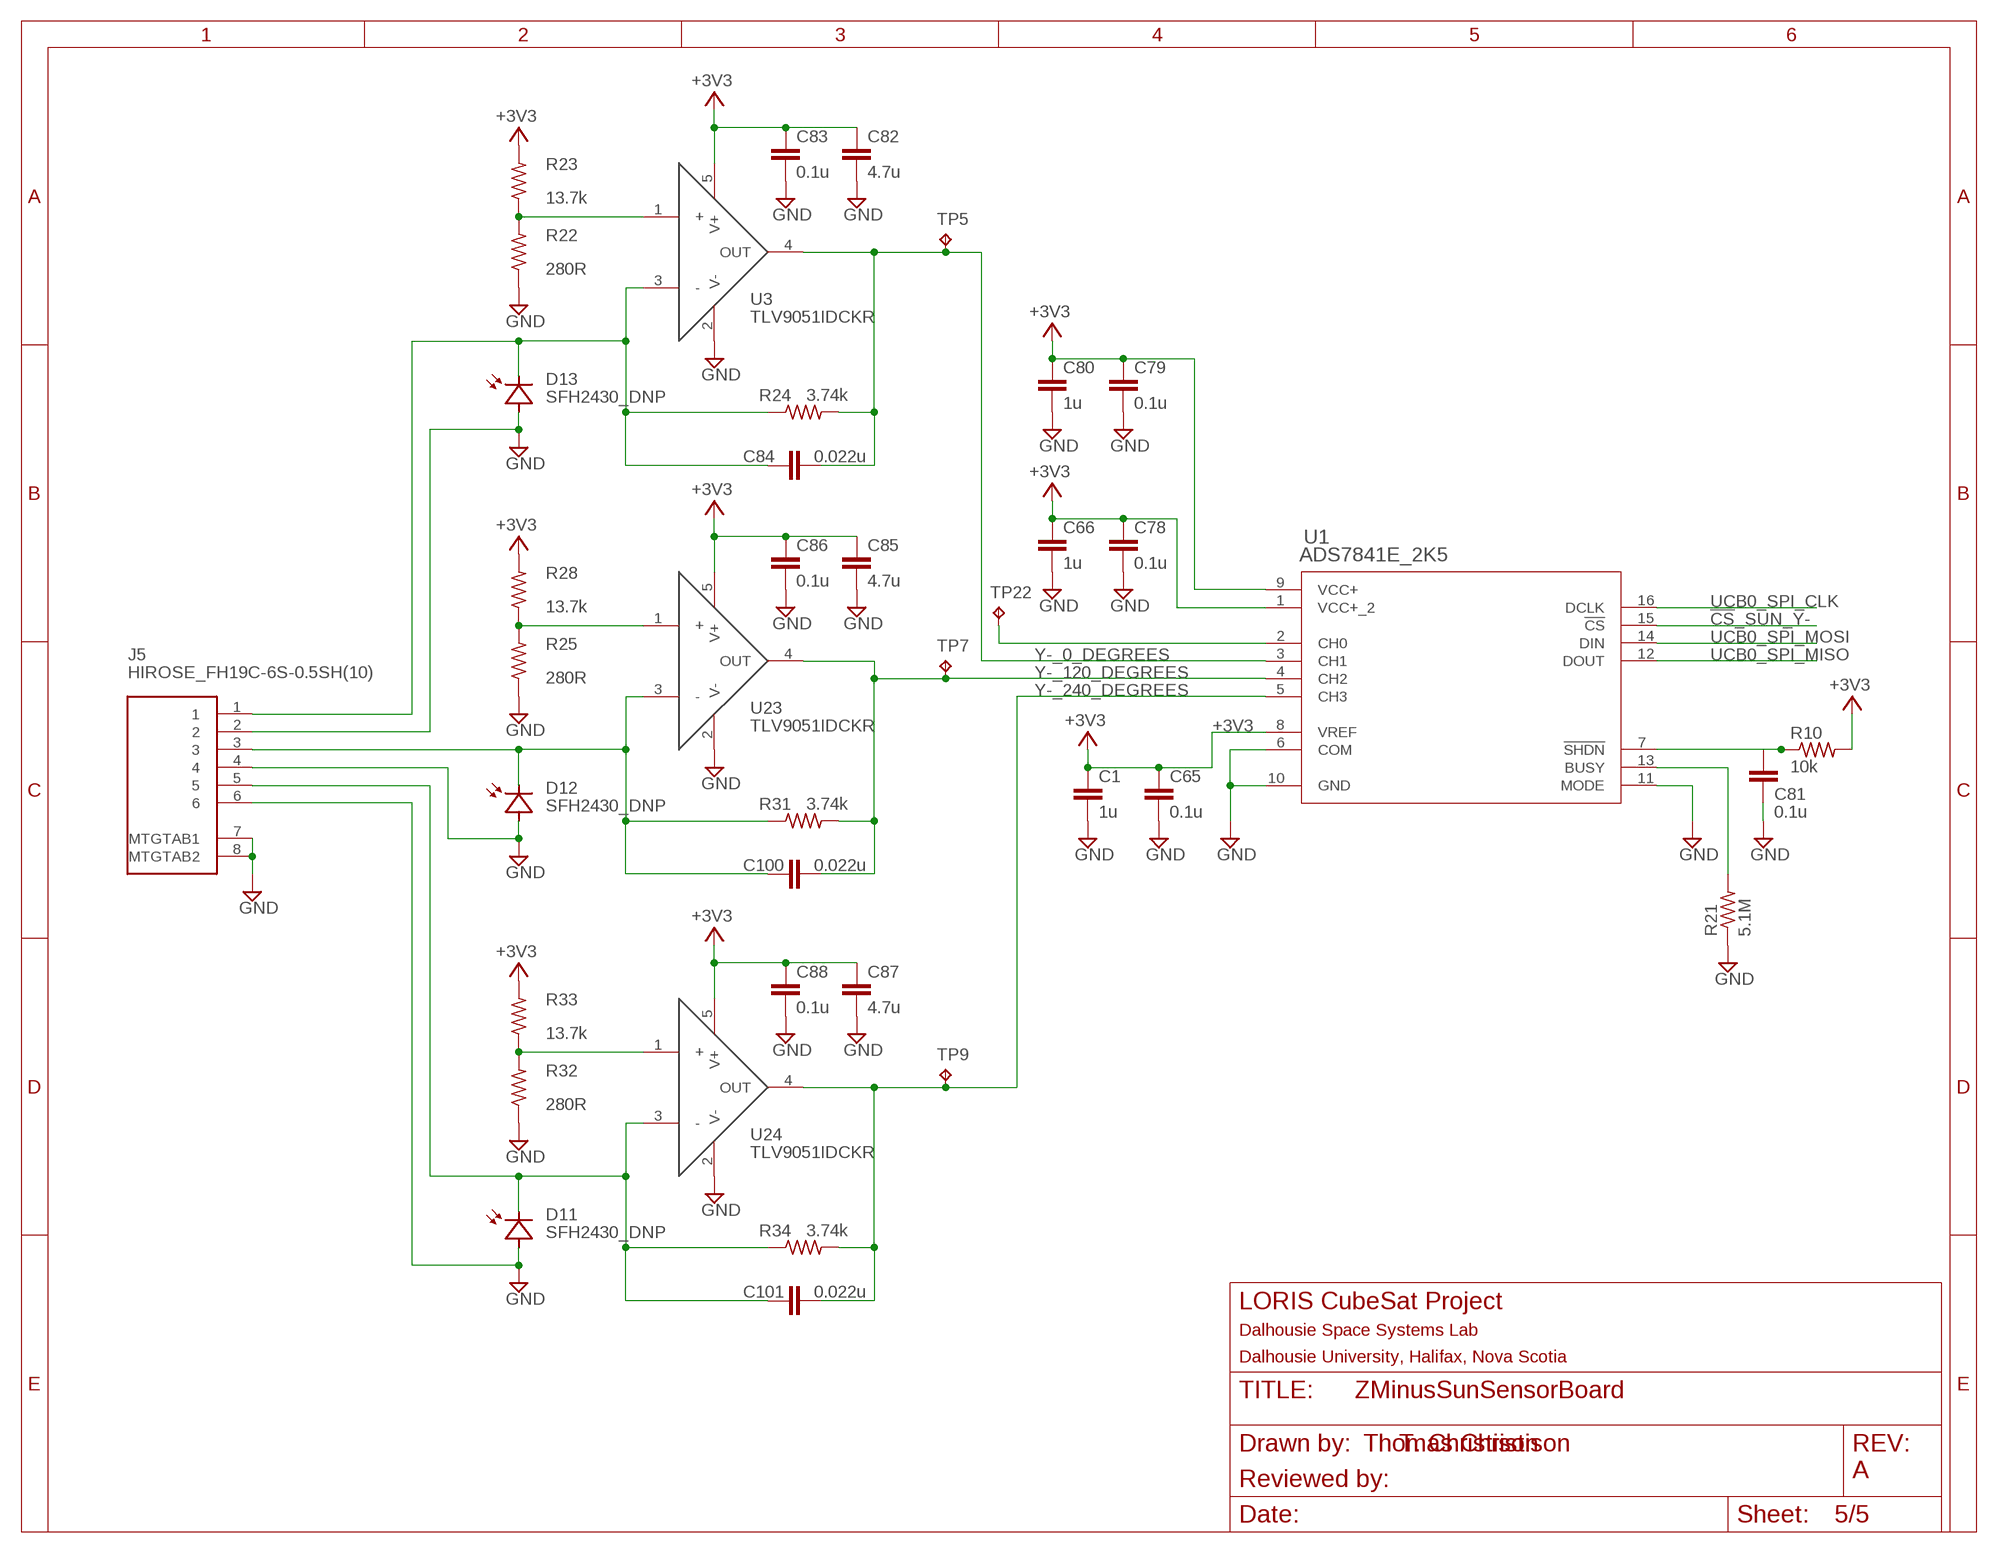
[diagram p4: schematic, sheet 5]

### Parts
C1  1u  C-EUC0402  [C0402]
C65  0.1u  C-EUC0402  [C0402]
C66  1u  C-EUC0402  [C0402]
C78  0.1u  C-EUC0402  [C0402]
C79  0.1u  C-EUC0402  [C0402]
C80  1u  C-EUC0402  [C0402]
C81  0.1u  C-EUC0402  [C0402]
C82  4.7u  C-EUC0402  [C0402]
C83  0.1u  C-EUC0402  [C0402]
C84  0.022u  C-EUC0402  [C0402]
C85  4.7u  C-EUC0402  [C0402]
C86  0.1u  C-EUC0402  [C0402]
C87  4.7u  C-EUC0402  [C0402]
C88  0.1u  C-EUC0402  [C0402]
C100  0.022u  C-EUC0402  [C0402]
C101  0.022u  C-EUC0402  [C0402]
J5  HIROSE_FH19C-6S-0.5SH(10)  [HIROSE_FH19C-6S-0.5SH(10)]
R10  10k  R-US_R0402  [R0402]
R21  5.1M  R-US_R0402  [R0402]
R22  280R  R-US_R0402  [R0402]
R23  13.7k  R-US_R0402  [R0402]
R24  3.74k  R-US_R0402  [R0402]
R25  280R  R-US_R0402  [R0402]
R28  13.7k  R-US_R0402  [R0402]
R31  3.74k  R-US_R0402  [R0402]
R32  280R  R-US_R0402  [R0402]
R33  13.7k  R-US_R0402  [R0402]
R34  3.74k  R-US_R0402  [R0402]
TP5  TESTPOINT  [TP_P76H50]
TP7  TESTPOINT  [TP_P76H50]
TP9  TESTPOINT  [TP_P76H50]
TP22  TESTPOINT  [TP_P76H50]
U1  ADS7841E_2K5  [DBQ16]
U3  TLV9051IDCKR  [SC70-5P65_210X110L36X22N_TLV9051]
U23  TLV9051IDCKR  [SC70-5P65_210X110L36X22N_TLV9051]
U24  TLV9051IDCKR  [SC70-5P65_210X110L36X22N_TLV9051]

### Nets
!CS!_SUN_Y-: U1.15(!CS) ; also sheet 1
+3V3: C1.1 C65.1 C66.1 C78.1 C79.1 C80.1 C82.1 C83.1 C85.1 C86.1 C87.1 C88.1 R10.2 R23.2 R28.2 R33.2 U1.1(VCC+_2) U1.8(VREF) U1.9(VCC+) U3.5(V+) U23.5(V+) U24.5(V+) ; also sheet 1,2,3,4
GND: C1.2 C65.2 C66.2 C78.2 C79.2 C80.2 C81.2 C82.2 C83.2 C85.2 C86.2 C87.2 C88.2 J5.2 J5.4 J5.6 J5.7(MTGTAB1) J5.8(MTGTAB2) R21.1 R22.1 R25.1 R32.1 U1.6(COM) U1.10(GND) U1.11(MODE) U3.2(V-) U23.2(V-) U24.2(V-) ; also sheet 1,2,3,4
N$14: TP22.1(TP) U1.2(CH0)
N$23: C100.1 J5.3 R31.1 U23.3(-)
N$24: C81.1 R10.1 U1.7(!SHDN)
N$29: C84.1 J5.1 R24.1 U3.3(-)
N$31: R22.2 R23.1 U3.1(+)
N$34: R25.2 R28.1 U23.1(+)
N$35: C101.1 J5.5 R34.1 U24.3(-)
N$36: R32.2 R33.1 U24.1(+)
N$53: R21.2 U1.13(BUSY)
UCB0_SPI_CLK: U1.16(DCLK) ; also sheet 1,2,3,4
UCB0_SPI_MISO: U1.12(DOUT) ; also sheet 1,2,3,4
UCB0_SPI_MOSI: U1.14(DIN) ; also sheet 1,2,3,4
Y-_0_DEGREES: C84.2 R24.2 TP5.1(TP) U1.3(CH1) U3.4(OUT)
Y-_120_DEGREES: C100.2 R31.2 TP7.1(TP) U1.4(CH2) U23.4(OUT)
Y-_240_DEGREES: C101.2 R34.2 TP9.1(TP) U1.5(CH3) U24.4(OUT)

### Notes on the sheet
- Thomas Christison
- A

## Library data of the parts
A1 = my_library:XY_SUN_SENSOR
C1 C14-C16 C19-C22 C26 C27 C29 C31-C33 C45-C55 C65-C116 = resistor:C-EU: CAPACITOR, European symbol
C12 C25 C28 C30 = rcl:C-EU: CAPACITOR, European symbol; SPICEPREFIX: C
J2-J5 = my_library:HIROSE_FH19C-6S-0.5SH(10)
JP1 = pinhead:PINHD-1X2: PIN HEADER
JP3 = pinhead:PINHD-2X5: PIN HEADER
LED1 = led:LED: LED OSRAM: - CHIPLED LG R971, LG N971, LY N971, LG Q971, LY Q971, LO R971, LY R971 LH N974, LH R974 LS Q976, LO Q976, LY Q976 LO Q996 - Hyper CHIPLED LW Q18S LB Q993, LB Q99A, LB R99A - SideLED LS A670, LO A670, LY A670, LG A670, LP A670 LB A673, LV A673, LT A673, LW A673 LH A674 LY A675 LS A676, LA A676, LO A676, LY A676, LW A676 LS A679, LY A679, LG A679 - Hyper Micro SIDELED® LS Y876, LA Y876, LO Y876, LY Y876 LT Y87S - SmartLED LW L88C, LW L88S LB L89C, LB L89S, LG L890 LS L89K, LO L89K, LY L89K LS L896, LA L896, LO L896, LY L896 - TOPLED LS T670, LO T670, LY T670, LG T670, LP T670 LSG T670, LSP T670, LSY T670, LOP T670, LYG T670 LG T671, LOG T671, LSG T671 LB T673, LV T673, LT T673, LW T673 LH T674 LS T676, LA T676, LO T676, LY T676, LB T676, LH T676, LSB T676, LW T676 LB T67C, LV T67C, LT T67C, LS T67K, LO T67K, LY T67K, LW E67C LS E67B, LA E67B, LO E67B, LY E67B, LB E67C, LV E67C, LT E67C LW T67C LS T679, LY T679, LG T679 LS T770, LO T770, LY T770, LG T770, LP T770 LB T773, LV T773, LT T773, LW T773 LH T774 LS E675, LA E675, LY E675, LS T675 LS T776, LA T776, LO T776, LY T776, LB T776 LHGB T686 LT T68C, LB T68C - Hyper Mini TOPLED® LB M676 - Mini TOPLED Santana® LG M470 LS M47K, LO M47K, LY M47K Source: http://www.osram.convergy.de LUXEON: - LUMILED® LXK2-PW12-R00, LXK2-PW12-S00, LXK2-PW14-U00, LXK2-PW14-V00 LXK2-PM12-R00, LXK2-PM12-S00, LXK2-PM14-U00 LXK2-PE12-Q00, LXK2-PE12-R00, LXK2-PE12-S00, LXK2-PE14-T00, LXK2-PE14-U00 LXK2-PB12-K00, LXK2-PB12-L00, LXK2-PB12-M00, LXK2-PB14-N00, LXK2-PB14-P00, LXK2-PB14-Q00 LXK2-PR12-L00, LXK2-PR12-M00, LXK2-PR14-Q00, LXK2-PR14-R00 LXK2-PD12-Q00, LXK2-PD12-R00, LXK2-PD12-S00 LXK2-PH12-R00, LXK2-PH12-S00 LXK2-PL12-P00, LXK2-PL12-Q00, LXK2-PL12-R00 Source: www.luxeon.com KINGBRIGHT: KA-3528ASYC Source: www.kingbright.com
MH5-MH8 = my_library:MTGP700H400
R1 R3 R7-R9 R13-R15 R17 R19 R20 R22-R25 R28 R31-R34 R38-R40 R44-R46 R50-R70 = resistor:R-US_: RESISTOR, American symbol
R2 R4-R6 R10-R12 R16 R18 R21 R26 = rcl:R-US_: RESISTOR, American symbol; SPICEPREFIX: R
TP1-TP22 = my_library:TESTPOINT
U1 U2 U13 U25 U27 = my_library:ADS7841E_2K5; DATASHEET_URL: http://www.ti.com/lit/gpn/ADS7841; DESCRIPTION: 12-Bit, 4-Channel Serial Output Sampling Analog-to-Digital Converter; FAMILY_NAME: PRECISION ADC (<=10MSPS); GENERIC_PART_NUMBER: ADS7841; INDUSTRY_STD_PKG_TYPE: SSOP/QSOP; MANUFACTURER: Texas Instruments; PACKAGE_DESIGNATOR: DBQ; PIN_COUNT: 16
U3 U6 U8 U9 U15 U19 U21 U23 U24 U26 U28-U32 = my_library:TLV9051
U4 = my_library:LM20BIM7X_NOPB

## Board
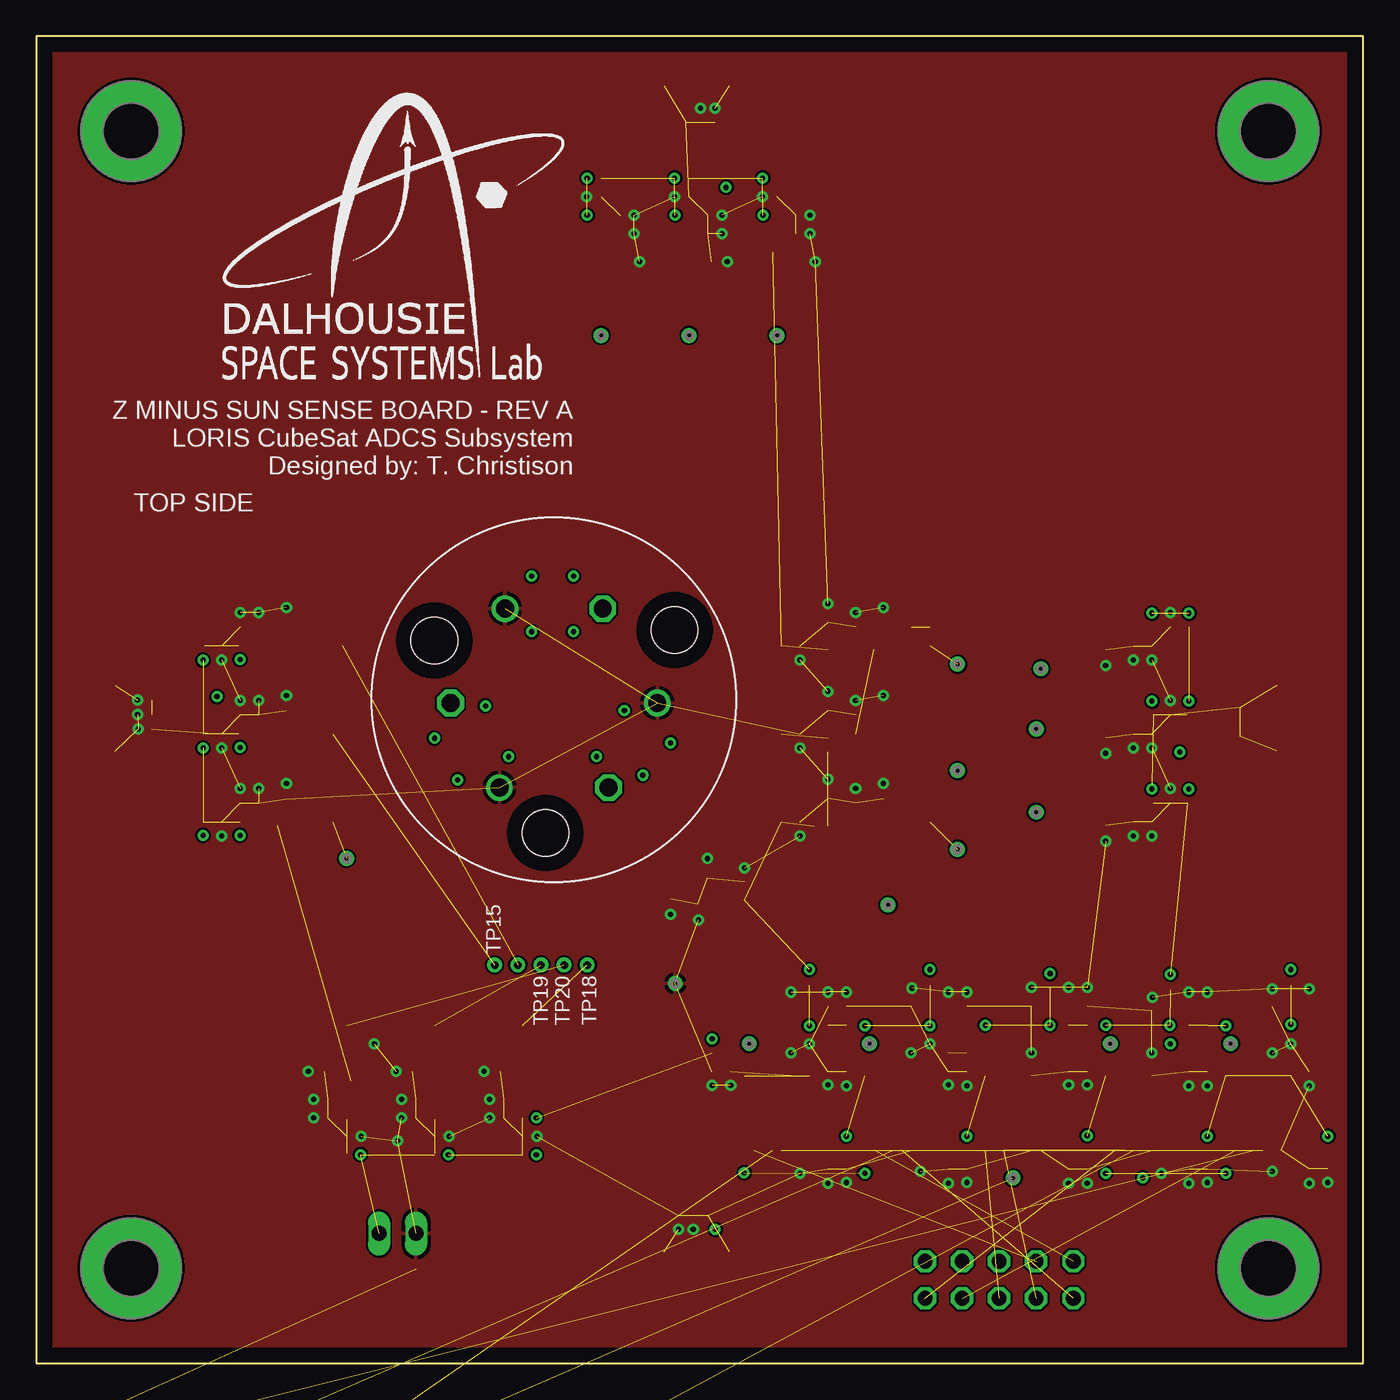
[diagram p5: board, top side]
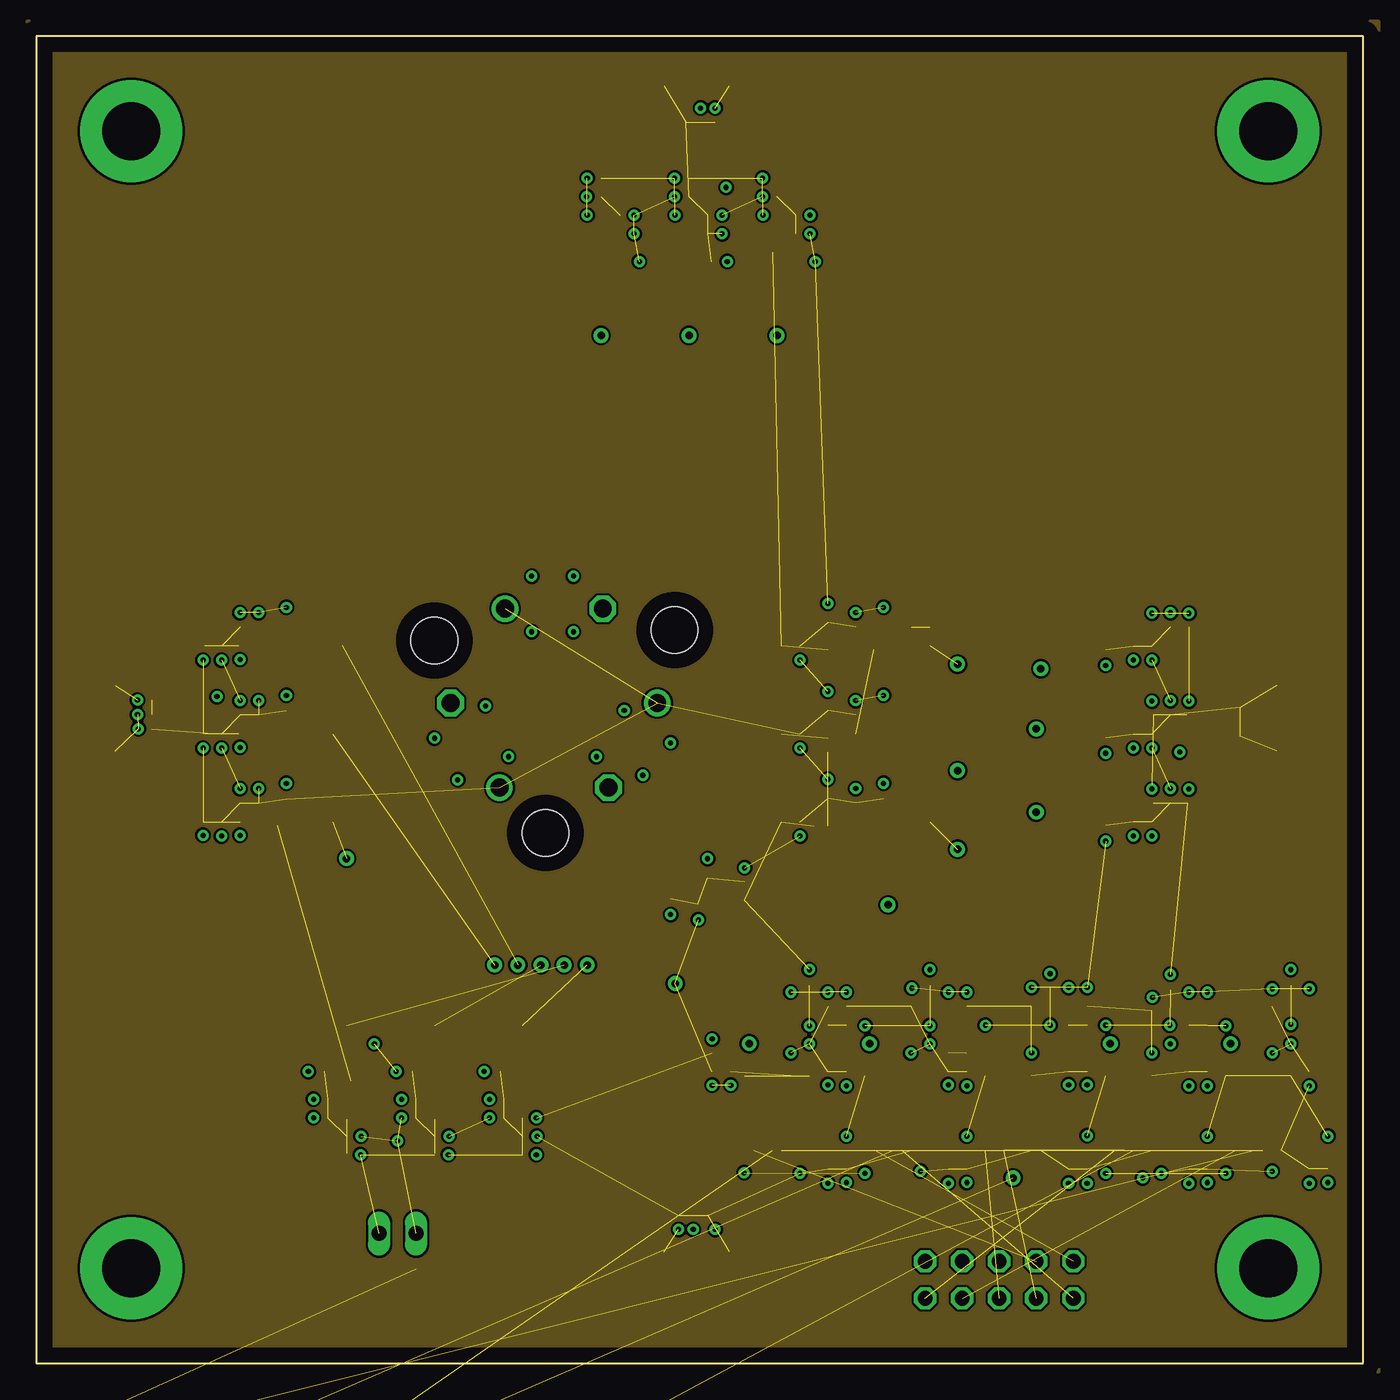
[diagram p6: board, inner layer Route2]
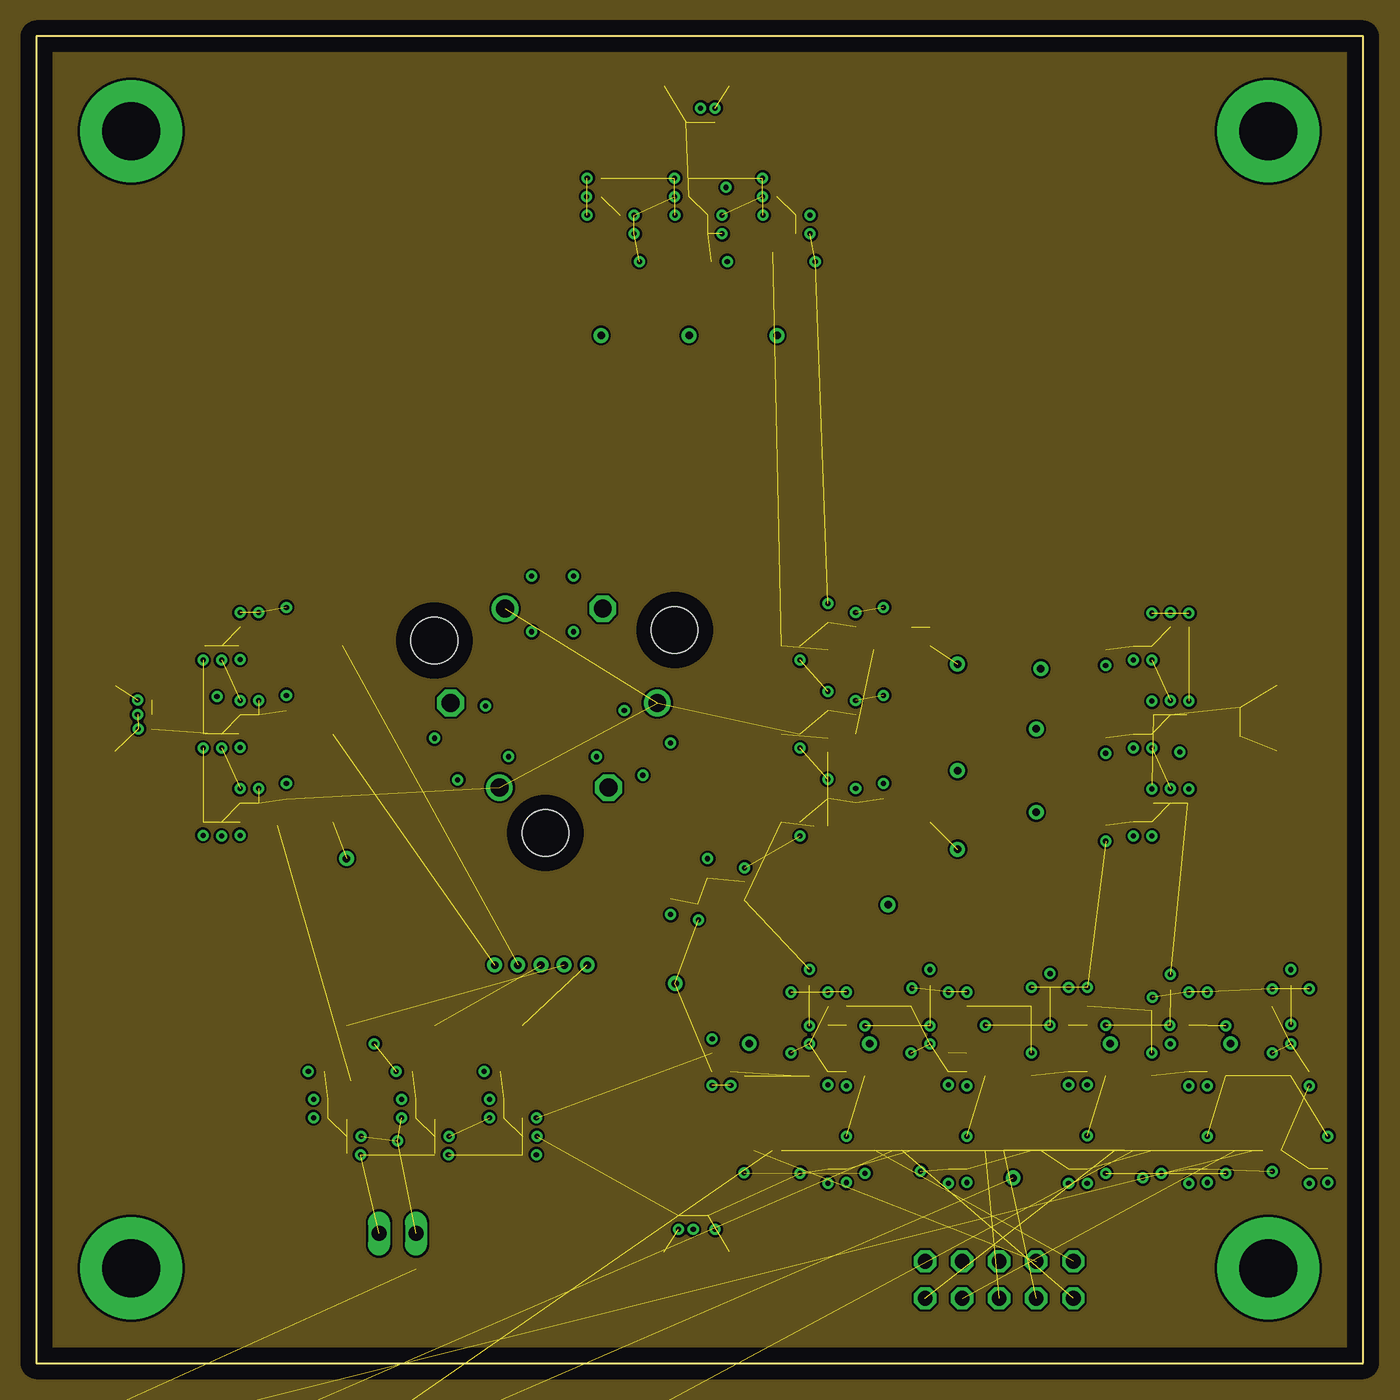
[diagram p7: board, inner layer Route15]
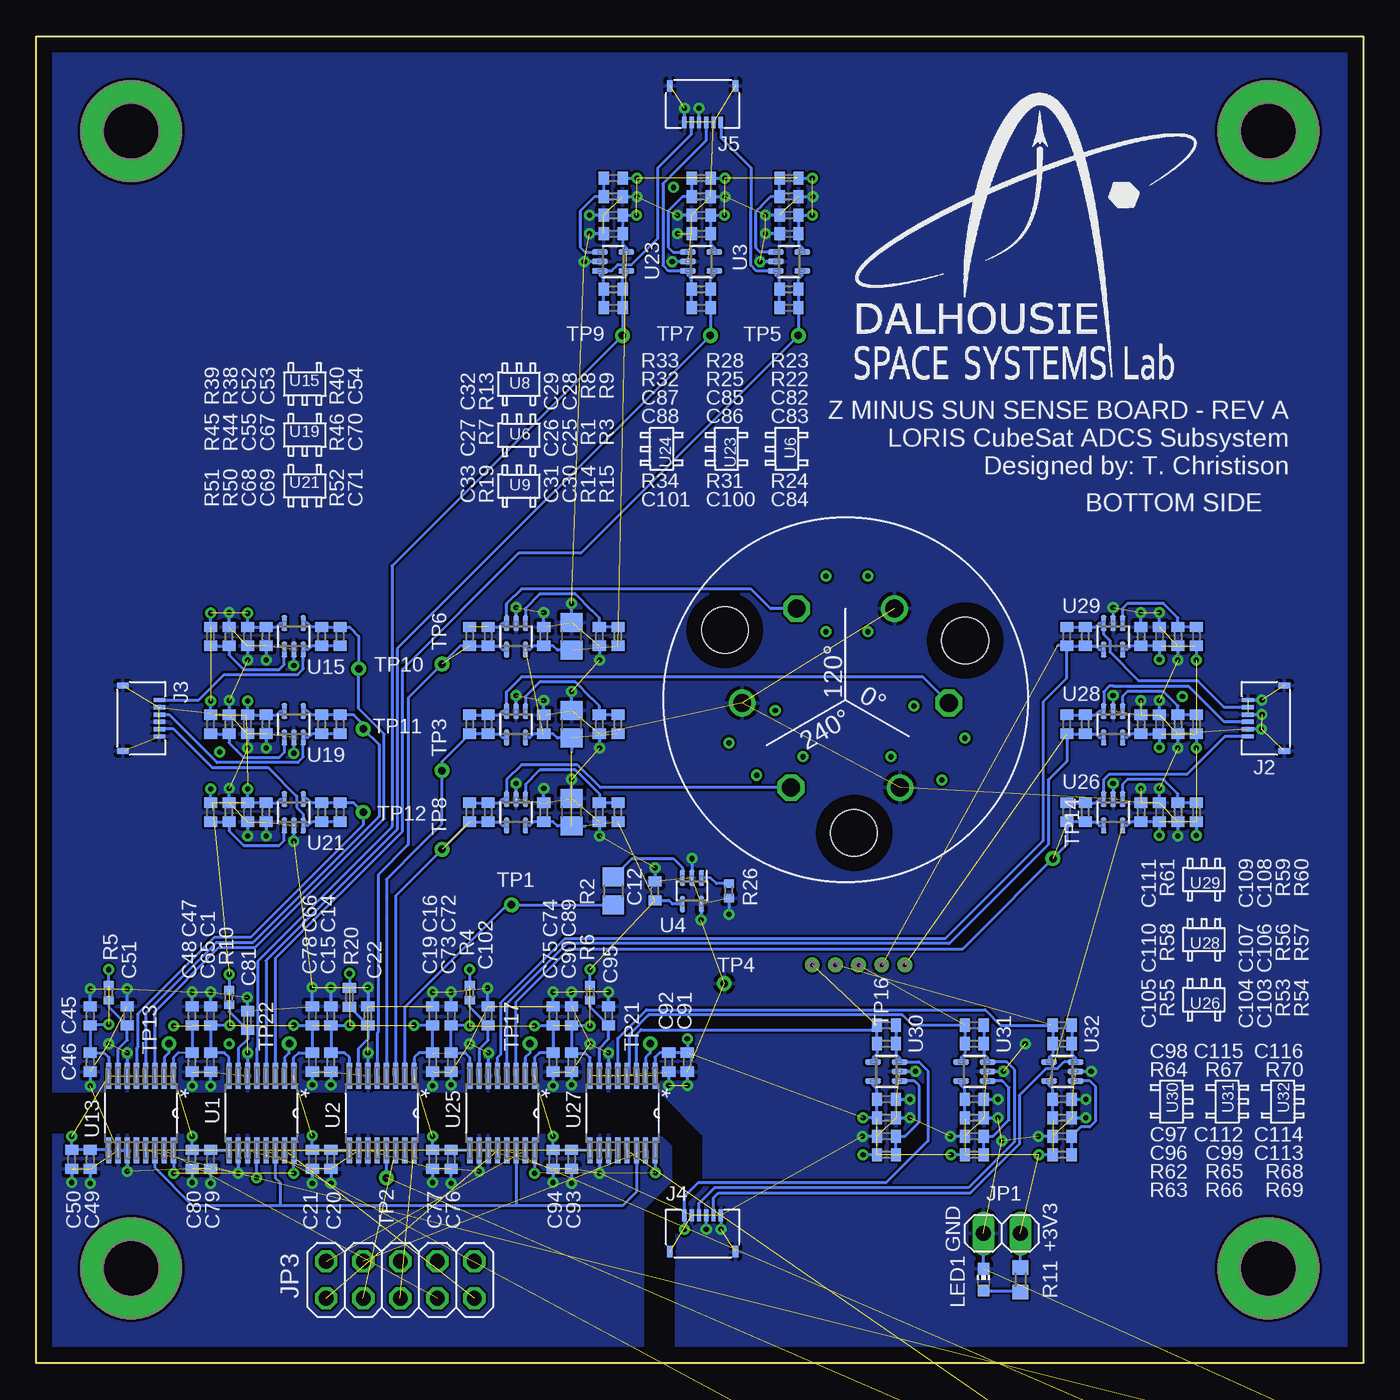
[diagram p8: board, bottom side, seen from below]

Size 91 x 91 mm. Coordinates in mm from the lower left corner, seen from the top.
Outline: 0,0 91,0 91,91 0,91 0,0
Copper layers (1*16): Top 0.035mm / dielectric 1.5mm / Bottom 0.035mm
Design rules "default": minimum track width 6mil, minimum drill 0.35mm, track to track 6mil, track to pad 6mil, pad to pad 6mil, via to via 6mil, smd to smd 6mil, copper to edge 40mil, drill to drill 6mil, minimum pad ring 10mil, minimum via ring 8mil, stop-mask expansion 4mil, vias tented up to drill 0mil, thermal gap 10mil

### Footprints (pad centres in the part's own frame; a part is rotated, then mirrored left to right if it is on the bottom)
XY_SUN_SENOR_MASK = drill 1.219: A1 6.25,-3.35; A2 -0.224,7.088; A3 -6.026,-3.738 | drill 1.219 octagon: C1 6.25,3.35; C2 -6.026,3.738; C3 -0.224,-7.088 | hole 3.2: 5.08,-7.62; -9.56,0; 5.08,7.62
C0402 = smd 0.7 x 0.9: 1 -0.65,0; 2 0.65,0
C0805 = smd 1.3 x 1.5: 1 -0.95,0; 2 0.95,0
HIROSE_FH19C-6S-0.5SH(10) = smd 0.3 x 0.8: 1 -1.25,1.25; 2 -0.75,1.25; 3 -0.25,1.25; 4 0.25,1.25; 5 0.75,1.25; 6 1.25,1.25 | smd 0.4 x 0.8: 7 -2.25,-1.25; 8 2.25,-1.25
1X02 = drill 1.016 long: 1 -1.27,0; 2 1.27,0
2X05 = drill 1.016 octagon: 1 -5.08,-1.27; 2 -5.08,1.27; 3 -2.54,-1.27; 4 -2.54,1.27; 5 0,-1.27; 6 0,1.27; 7 2.54,-1.27; 8 2.54,1.27; 9 5.08,-1.27; 10 5.08,1.27
CHIP-LED0603 = smd 0.8 x 0.8: A 0,-0.75; C 0,0.75
MTGP700H400 = drill 4 pad 7: 1 0,0
R0402 = smd 0.7 x 0.9: 1 -0.65,0; 2 0.65,0
R0805 = smd 1.3 x 1.5: 1 -0.95,0; 2 0.95,0
R0402' = smd 0.6 x 0.7: 1 -0.5,0; 2 0.5,0
R0603 = smd 1 x 1.1: 1 -0.85,0; 2 0.85,0
TP_P76H50 = drill 0.51 pad 0.762: 1 0,0
DBQ16 = smd 1.803 x 0.356: 1 -2.553,2.223; 2 -2.553,1.587; 3 -2.553,0.953; 4 -2.553,0.318; 5 -2.553,-0.318; 6 -2.553,-0.953; 7 -2.553,-1.587; 8 -2.553,-2.223; 9 2.553,-2.223; 10 2.553,-1.587; 11 2.553,-0.953; 12 2.553,-0.318; 13 2.553,0.318; 14 2.553,0.953; 15 2.553,1.587; 16 2.553,2.223
SC70-5P65_210X110L36X22N_TLV9051 = smd 0.38 x 1.09: 1 -0.65,-0.91; 2 0,-0.91; 3 0.65,-0.91; 4 0.65,0.91; 5 -0.65,0.91
SOT23-5P65_210X110L40X22N_LM20 = smd 0.38 x 1.11: 1 -0.65,-0.9; 2 0,-0.9; 3 0.65,-0.9; 4 0.65,0.9; 5 -0.65,0.9

### Placement (x,y rotation side)
A1  35.5,45.5 330 bottom
C1  79.06,23.81 90 bottom
C12  48.58,32.38 90 bottom
C14  70.8,23.81 90 bottom
C15  70.8,20.64 270 bottom
C16  63.82,23.81 90 bottom
C19  63.82,20.64 270 bottom
C20  70.8,13.97 270 bottom
C21  72.07,13.97 270 bottom
C22  68.26,23.81 90 bottom
C25  54.29,43.81 90 bottom
C26  56.2,43.81 90 bottom
C27  61.28,43.81 270 bottom
C28  54.29,49.85 90 bottom
C29  56.2,49.85 90 bottom
C30  54.29,37.78 90 bottom
C31  56.2,37.78 90 bottom
C32  61.28,49.85 270 bottom
C33  61.28,37.78 270 bottom
C45  87.31,23.81 90 bottom
C46  87.31,20.64 270 bottom
C47  80.33,23.81 90 bottom
C48  80.33,20.64 270 bottom
C49  87.31,13.97 270 bottom
C50  88.58,13.97 270 bottom
C51  84.77,23.81 90 bottom
C52  76.52,49.85 270 bottom
C53  75.25,49.85 270 bottom
C54  70.17,49.85 90 bottom
C55  76.52,43.81 270 bottom
C65  79.06,20.64 270 bottom
C66  72.07,23.81 90 bottom
C67  75.25,43.81 270 bottom
C68  76.52,37.78 270 bottom
C69  75.25,37.78 270 bottom
C70  70.17,43.81 90 bottom
C71  70.17,37.78 90 bottom
C72  62.55,23.81 90 bottom
C73  62.55,20.64 270 bottom
C74  55.56,23.81 90 bottom
C75  55.56,20.64 270 bottom
C76  62.55,13.97 270 bottom
C77  63.82,13.97 270 bottom
C78  72.07,20.64 270 bottom
C79  79.06,13.97 270 bottom
C80  80.33,13.97 270 bottom
C81  76.52,23.5 90 bottom
C82  39.37,78.74 180 bottom
C83  39.37,77.47 180 bottom
C84  39.37,72.39 0 bottom
C85  45.4,78.74 180 bottom
C86  45.4,77.47 180 bottom
C87  51.44,78.74 180 bottom
C88  51.44,77.47 180 bottom
C89  54.29,23.81 90 bottom
C90  54.29,20.64 270 bottom
C91  46.35,20.64 270 bottom
C92  47.62,20.64 270 bottom
C93  54.29,13.97 270 bottom
C94  55.56,13.97 270 bottom
C95  51.75,23.81 90 bottom
C96  32.7,16.83 0 bottom
C97  32.7,18.1 0 bottom
C98  32.7,23.18 180 bottom
C99  26.67,16.83 0 bottom
C100  45.4,72.39 0 bottom
C101  51.44,72.39 0 bottom
C102  60.01,23.81 90 bottom
C103  13.97,37.78 90 bottom
C104  15.24,37.78 90 bottom
C105  20.32,37.78 270 bottom
C106  13.97,43.81 90 bottom
C107  15.24,43.81 90 bottom
C108  13.97,49.85 90 bottom
C109  15.24,49.85 90 bottom
C110  20.32,43.81 270 bottom
C111  20.32,49.85 270 bottom
C112  26.67,18.1 0 bottom
C113  20.64,16.83 0 bottom
C114  20.64,18.1 0 bottom
C115  26.67,23.18 180 bottom
C116  20.64,23.18 180 bottom
J2  6.66,44.23 90 bottom
J3  83.82,44.23 270 bottom
J4  45.3,8.89 0 bottom
J5  45.3,86.36 180 bottom
JP1  24.77,8.89 180 bottom
JP3  66.04,5.71 0 bottom
LED1  26.04,5.71 0 bottom
MH5  6.5,6.5 0 top
MH6  84.5,6.5 0 top
MH7  84.5,84.5 0 top
MH8  6.5,84.5 0 top
R1  52.39,43.81 90 bottom
R2  51.44,32.38 270 bottom
R3  51.12,43.81 270 bottom
R4  10k  [R0402']  61.28,25.4 90 bottom
R5  10k  [R0402']  86.04,25.4 90 bottom
R6  10k  [R0402']  53.02,25.4 90 bottom
R7  60.01,43.81 270 bottom
R8  52.39,49.85 90 bottom
R9  51.12,49.85 270 bottom
R10  10k  [R0402']  77.79,25.08 90 bottom
R11  23.5,5.71 90 bottom
R12  5.1M  [R0402']  -3.17,-6.99 0 top  (outside the outline)
R13  60.01,49.85 270 bottom
R14  52.39,37.78 90 bottom
R15  51.12,37.78 270 bottom
R16  5.1M  [R0402']  -3.17,-12.06 0 top  (outside the outline)
R17  -2.54,-17.14 0 top  (outside the outline)
R18  5.1M  [R0402']  -3.17,-22.23 0 top  (outside the outline)
R19  60.01,37.78 270 bottom
R20  69.53,25.08 90 bottom
R21  5.1M  [R0402']  -3.17,-27.3 0 top  (outside the outline)
R22  39.37,80.01 180 bottom
R23  39.37,81.28 0 bottom
R24  39.37,73.66 0 bottom
R25  45.4,80.01 180 bottom
R26  5.1M  [R0402']  43.5,32.38 270 bottom
R28  45.4,81.28 0 bottom
R31  45.4,73.66 0 bottom
R32  51.44,80.01 180 bottom
R33  51.44,81.28 0 bottom
R34  51.44,73.66 0 bottom
R38  77.79,49.85 270 bottom
R39  79.06,49.85 90 bottom
R40  71.44,49.85 90 bottom
R44  77.79,43.81 270 bottom
R45  79.06,43.81 90 bottom
R46  71.44,43.81 90 bottom
R50  77.79,37.78 270 bottom
R51  79.06,37.78 90 bottom
R52  71.44,37.78 90 bottom
R53  12.7,37.78 90 bottom
R54  11.43,37.78 270 bottom
R55  19.05,37.78 270 bottom
R56  12.7,43.81 90 bottom
R57  11.43,43.81 270 bottom
R58  19.05,43.81 270 bottom
R59  12.7,49.85 90 bottom
R60  11.43,49.85 270 bottom
R61  19.05,49.85 270 bottom
R62  32.7,15.56 0 bottom
R63  32.7,14.29 180 bottom
R64  32.7,21.91 180 bottom
R65  26.67,15.56 0 bottom
R66  26.67,14.29 180 bottom
R67  26.67,21.91 180 bottom
R68  20.64,15.56 0 bottom
R69  20.64,14.29 180 bottom
R70  20.64,21.91 180 bottom
TP1  58.42,31.43 0 bottom
TP2  66.99,12.7 90 bottom
TP3  63.18,40.64 180 bottom
TP4  43.81,26.04 0 bottom
TP5  38.73,70.48 90 bottom
TP6  63.18,47.94 180 bottom
TP7  44.77,70.48 90 bottom
TP8  63.18,35.24 180 bottom
TP9  50.8,70.48 90 bottom
TP10  68.9,47.62 180 bottom
TP11  68.58,43.5 180 bottom
TP12  68.58,37.78 180 bottom
TP13  81.92,21.91 90 bottom
TP14  21.27,34.61 180 bottom
TP15  31.43,27.3 90 top
TP16  33.02,27.3 90 top
TP17  57.15,21.91 90 bottom
TP18  37.78,27.3 0 top
TP19  34.61,27.3 0 top
TP20  36.2,27.3 0 top
TP21  48.9,21.91 90 bottom
TP22  73.66,21.91 90 bottom
U1  75.56,17.14 270 bottom
U2  67.31,17.14 270 bottom
U3  39.37,75.56 270 bottom
U4  46.04,32.38 180 bottom
U6  58.1,43.81 180 bottom
U8  58.1,49.85 180 bottom
U9  58.1,37.78 180 bottom
U13  83.82,17.14 270 bottom
U15  73.34,49.85 0 bottom
U19  73.34,43.81 0 bottom
U21  73.34,37.78 0 bottom
U23  45.4,75.56 270 bottom
U24  51.44,75.56 270 bottom
U25  59.05,17.14 270 bottom
U26  17.14,37.78 180 bottom
U27  50.8,17.14 270 bottom
U28  17.14,43.81 180 bottom
U29  17.14,49.85 180 bottom
U30  32.7,20 90 bottom
U31  26.67,20 90 bottom
U32  20.64,20 90 bottom

### Tracks (layer width: path | path; a pad name or v marks a point on that pad's centre or on a via)
0_DEGREES
  Bottom 0.203: U6.4 59.05,42.91 59.31,43.16 R7.2 C27.2 63.18,41.26 TP3.1 63.18,36.99 64.61,35.56 66.99,33.18 66.99,31.92 66.99,30.48 U2.4
120_DEGREES  (1 unrouted)
  Bottom 0.203: U8.4 59.05,48.94 59.31,49.2 R13.2 C32.2 | 61.29,49.21 C32.2 | C32.2 61.93,49.2 65.5,45.63 65.5,35.56 67.56,33.5 67.56,22.71 67.63,22.64 U2.5
240_DEGREES  (1 unrouted)
  Bottom 0.203: U9.4 59.05,36.87 59.31,37.13 R19.2 C33.2 66.36,32.05 U2.3
!CS!_SUN_X+  (1 unrouted)
!CS!_SUN_X-  (1 unrouted)
!CS!_SUN_Y+  (1 unrouted)
!CS!_SUN_Y-  (1 unrouted)
+3V2
  pour Route15 (rank 6, no thermals): -4.45,93.98 -4.45,-3.81 95.25,-3.81 95.25,92.71 95.25,93.98
+3V3  (via drill 0.35)  (52 unrouted)
  Bottom 0.152: C48.1 81.27,21.29
  Bottom 0.203: U6.5 57.15,42.91 56.89,43.16 C26.1 55.56,43.16 55.26,42.87 C25.1 54.29,41.91 | 63.79,21.26 C19.1 | U8.5 57.15,48.94 56.89,49.2 C29.1 55.56,49.2 55.26,48.9 C28.1 | C14.1 | C14.1 C15.1 69.86,21.29 69.53,20.95 U2.8 | U9.5 57.15,36.87 56.89,37.13 C31.1 55.56,37.13 55.26,36.83 C30.1 53.34,36.83 | U4.4 46.74,31.43 | C14.1 70.79,23.18 | U26.5 16.19,36.87 15.93,37.13 C104.1 C103.1 v13.97,36.2 | C106.1 C107.1 15.93,43.16 16.19,42.91 U28.5 | v63.82,15.56 C77.1 C76.1 62.52,14.59 U25.9 | v56.83,23.13 56.8,23.16 C74.1 C75.1 56.5,21.29 56.83,20.95 U25.1 | v53.02,23.13 53.05,23.16 C89.1 54.31,23.15 54.31,21.35 C90.1 54.26,21.26 53.34,21.26 53.02,20.94 U27.8 | C108.1 C109.1 15.93,49.2 16.19,48.94 U29.5 | U15.5 74.3,50.76 74.56,50.5 C53.1 C52.1 v76.52,51.44 | C55.1 C67.1 74.56,44.47 74.3,44.73 U19.5 | C68.1 C69.1 74.56,38.43 74.3,38.69 U21.5 | U30.5 33.61,19.05 33.35,18.79 C97.1 C96.1 v34.29,16.83 | U31.5 27.58,19.05 27.32,18.79 C112.1 C99.1 27.32,16.72 | U32.5 21.55,19.05 21.29,18.79 C114.1 C113.1 21.29,16.72 | U3.5 38.46,76.52 38.72,76.78 C83.1 C82.1 v37.78,78.74 | U23.5 44.49,76.52 44.75,76.78 C86.1 C85.1 v43.81,78.74 | U24.5 50.52,76.52 50.78,76.78 C88.1 C87.1 v49.85,78.74 | R6.2 v53.02,26.99 | R63.2 v34.29,14.29 | 78.91,44.47 R45.2 v79.06,45.4 | v79.06,39.37 R51.2 78.95,38.43 | v22.23,14.29 R69.2 21.29,14.4 | R39.2 v79.06,51.44 | v11.43,42.18 R57.2 11.54,43.16 | v28.26,14.29 R66.2 27.32,14.4 | R33.2 v49.8,81.28 | R28.2 v43.77,81.28 | v11.43,48.22 R60.2 11.54,49.2 | U25.8 61.28,20.95 61.59,21.27 61.59,21.29 C73.1 C72.1 61.31,23.16 v61.28,23.13 | R5.2 v86.04,26.99 | v73.34,23.18 73.33,23.16 C66.1 C78.1 73.01,21.29 73.34,20.95 U1.1
  Bottom 0.203: v86.04,23.22 87.25,23.22 C45.1 C46.1 86.36,21.29 86.04,20.97 U13.8 | U27.9 53.05,14.62 C93.1 C94.1 v55.56,15.56 | U13.1 81.6,20.95 81.27,21.29 | C48.1 C47.1 80.36,23.13 | v61.28,26.99 R4.2 | U1.8 77.79,20.95 78.12,21.29 C65.1 C1.1 79.07,23.18 v77.74,23.18 | v77.79,26.67 R10.2 | U27.1 48.58,20.97 48.26,21.29 C92.1 C91.1 v46.35,22.23 | R23.2 v37.78,81.28 | C68.1 76.63,38.43 | C55.1 76.63,44.47 | C108.1 13.86,49.2 | C106.1 13.86,43.16 | v88.58,15.56 C50.1 C49.1 86.04,14.62 86.02,14.59 U13.9 | U1.9 79.03,14.59 C79.1 C80.1 v80.33,15.56 | C55.1 v76.52,45.4 | C68.1 v76.52,39.37 76.52,39.69 | C108.1 v13.97,48.26 | C106.1 v13.97,42.23 | R54.2 v11.43,36.2 | C12.1 47.62,31.73 47.38,31.48 U4.4 | U4.4 47.06,31.48 | C19.1 63.82,22.9 63.87,22.95 C16.1 63.83,23.18 v65.09,23.18 | C19.1 64.75,21.29 65.09,20.95 U2.1 | C14.1 69.55,23.16 v69.53,23.18 | v72.07,15.6 C21.1 C20.1 70.78,14.59 U2.9 | v69.53,26.71 R20.2 | R11.2 JP1.1
  other vias: 81.6,23.13
GND  (via drill 0.35)  (147 unrouted)
  Bottom 0.203: R26.2 v43.5,30.77 | v46.04,34.6 U4.2 | U4.5 45.4,31.47 v45.4,30.4 | v48.58,33.97 C12.2 | C15.2 v70.8,19.09 | C16.2 v63.82,25.44 | C19.2 v63.82,19.01 | C25.2 v54.29,46.08 | C26.2 v56.2,45.45 | U6.2 v58.1,45.8 | R1.1 v52.39,42.18 | C28.2 v54.29,52.11 | C29.2 v56.2,51.48 | U8.2 v58.1,51.83 | R8.1 v52.39,48.22 | C30.2 v54.29,40.05 | C31.2 v56.2,39.41 | U9.2 v58.1,39.77 | R14.1 v52.39,36.15 | C20.2 v70.8,12.34 | v68.26,25.76 C22.2 | C14.2 v70.8,25.76 | v79.06,19.01 C65.2 | C66.2 v72.07,25.76 | C78.2 v72.07,19.09 | C82.2 v41,78.74 | C83.2 v41,77.47 | R22.1 v37.74,80.01 | C85.2 v47.03,78.74 | U23.2 v47.39,75.56 | R25.1 v43.77,80.01 | C87.2 v53.07,78.74 | C88.2 v53.07,77.47 | U24.2 v53.42,75.56 | R32.1 v49.8,80.01 | C79.2 v79.06,12.34 | C80.2 v80.33,12.38 | U13.10 U13.11 v84.77,13.16 | C46.2 v87.31,19.01 | C47.2 v80.33,25.44 | C48.2 v80.33,19.01 | C52.2 v76.52,48.22 | C53.2 v75.25,48.22 | U15.2 v73.34,47.86 | R38.1 v77.79,51.48 | C55.2 v76.52,42.18 | C67.2 v75.25,42.18 | U19.2 v73.34,41.83 | v77.79,45.45 R44.1 | C68.2 v76.52,36.15 | C69.2 v75.25,36.15 | U21.2 v73.34,35.8 | R50.1 v77.79,39.41 | C51.2 v84.77,25.67 | C49.2 v87.31,12.34 | C50.2 v88.58,12.38 | C73.2 v62.55,19.09 | C72.2 v62.55,25.44 | C74.2 v55.56,25.44 | C75.2 v55.56,19.01 | C103.2 v13.97,39.41 | U26.2 v17.14,39.77 | R53.1 v12.7,36.15 | C106.2 v13.97,45.45 | U28.2 v17.14,45.8 | R56.1 v12.7,42.18 | C108.2 v13.97,51.48 | C109.2 v15.24,51.48 | U29.2 v17.14,51.83 | R59.1 v12.7,48.22 | v62.55,12.34 C76.2 | C77.2 v63.82,12.38 | C90.2 v54.29,19.09 | C89.2 v54.29,25.44 | C96.2 v31.07,16.83 | C97.2 v31.07,18.1 | U30.2 v30.72,20 | R62.1 v34.33,15.56 | C99.2 v25.04,16.83 | C112.2 v25.04,18.1 | U31.2 v24.68,20 | R65.1 v28.3,15.56 | C113.2 v19.01,16.83 | C114.2 v19.01,18.1 | U32.2 v18.65,20
  Bottom 0.203: R68.1 v22.27,15.56 | C95.2 v51.75,25.44 | C93.2 v54.29,12.34 | C94.2 v55.56,12.38 | U25.6 59.98,19.73 v59.98,21.27 | v60.05,25.72 60.05,24.51 C102.2 | v76.52,21.27 U1.6 | v60.64,13.16 U25.10 U25.11 | v47.62,19.05 C92.2 | v46.35,19.05 C91.2 | U1.11 U1.10 v77.15,13.02 | C45.2 v87.31,25.67 | v84.77,21.27 U13.6 | v51.75,21.27 U27.6 | C81.2 76.56,24.19 v76.56,25.08 | U3.2 v41.36,75.56 | v52.39,13.02 U27.10 U27.11 | C1.2 v79.06,25.44 | J5.4 v45.55,86.08 | J5.6 v46.55,86.08 | J4.4 v45.05,9.17 | J4.6 v44.05,9.17 | J2.4 v6.93,44.48 | J2.6 v6.93,45.48 | v6.99,43.5 7,43.48 J2.2 | C21.2 v72.07,12.34 | U2.6 v68.26,21.27 | LED1.C JP1.2
  other vias: 47.03,77.47 15.24,39.41 15.24,45.45 61.28,21.91 53.02,21.91 86.04,21.91 24.77,15.24 23.18,21.91
  pour Bottom: -2.22,93.03 -2.22,-2.22 13.02,-2.22 93.03,-2.22 93.03,94.3 89.85,94.3 -2.22,94.3
  pour Top: -3.81,95.25 95.25,95.25 95.25,-3.81 -3.81,-3.81 -3.81,-1.91
  cutout Bottom: 64.77,15.88 48.26,15.88 47.31,14.92 47.31,12.38 49.21,10.48 49.21,0.32 47.31,0.32 47.31,2.86 47.26,10.2 45.4,12.06 45.4,15.56 48.26,18.41 64.77,18.41
  cutout Bottom: 69.85,18.41 90.17,18.41 90.17,15.88 69.85,15.88
GND2
  pour Route2 (no thermals): -0.64,92.08 92.08,92.08 92.08,-0.64 -0.64,-0.64
N$1
  Bottom 0.203: U4.3 46.69,33.99 47.31,34.61 50.16,34.61 R2.1
N$2  (1 unrouted)
  Bottom 0.203: TP2.1 U2.13
N$3
  Bottom 0.203: C27.1 R7.1 59.31,44.47 59.05,44.73 U6.3 58.75,46.05 57.73,47.07 30.2,47.07 A1.C1
N$4
  Bottom 0.203: U25.7 60.61,19.73 60.61,21.53 60.01,22.14 C102.1 61.28,24.43 R4.1
N$5
  Bottom 0.203: U25.2 57.47,20.95 57.15,21.27 TP17.1
N$6
  Bottom 0.203: 52.42,44.44 R1.2 | R1.2 | U6.1 57.45,45.73 56.48,46.71 54.03,46.71 52.88,45.56 52.86,45.56 52.39,45.09 R1.2 | R1.2 | R3.1 R1.2
N$7
  Bottom 0.203: U4.1 44.77,33.28 44.37,32.88 R26.1
N$8  (1 unrouted)
  Bottom 0.203: R13.1 59.31,50.5 59.05,50.76 U8.3 58.75,52.07 | 58.75,52.07 58.75,52.08 | 58.75,52.07 58.73,52.09 57.73,53.1 41.99,53.1 40.64,51.75 A1.C2
N$9
  Bottom 0.203: 52.42,50.47 R8.2 | R8.2 | U8.1 57.45,51.77 56.48,52.74 54.03,52.74 52.88,51.59 52.86,51.59 52.39,51.12 R8.2 | 52.39,50.48 R8.2 | R9.1 R8.2
N$10
  Bottom 0.203: U13.2 82.23,20.95 81.92,21.27 TP13.1
N$11
  Bottom 0.203: TP21.1 48.9,21.27 49.21,20.95 U27.2
N$12
  Bottom 0.203: C33.1 R19.1 59.31,38.43 59.05,38.69 U9.3 58.73,38.71 58.73,40.03 57.73,41.04 53.88,41.04 52.32,39.47 A1.C3
N$13
  Bottom 0.203: 52.42,38.4 R14.2 | R14.2 | U9.1 57.45,39.7 56.48,40.68 54.03,40.68 52.39,39.04 R14.2 | 52.39,38.42 R14.2 | R15.1 R14.2
N$14
  Bottom 0.203: U1.2 73.98,20.95 73.66,21.27 TP22.1
N$15
  Bottom 0.203: R20.1 C22.1 68.26,22.23 68.9,21.59 U2.7
N$16  (via drill 0.35)
  other vias: 77.79,21.91
N$17  (via drill 0.35)
  other vias: 47.31,80.64
N$18  (via drill 0.35)
  other vias: 12.38,45.72
N$19  (via drill 0.35)
  other vias: 78.42,41.91
N$20  (via drill 0.35)
  other vias: 43.5,42.55
N$21  (via drill 0.35)
  other vias: 41.59,40.32
N$22
  Bottom 0.203: R5.1 86.04,24.45 84.77,23.18 C51.1 84.77,22.17 85.41,21.53 U13.7
N$23
  Bottom 0.203: C100.1 R31.1 46.05,74.35 46.31,74.61 U23.3 47.63,74.92 48.02,75.3 48.02,80.88 45.05,83.85 J5.3
N$24
  Bottom 0.203: U1.7 77.15,21.58 76.52,22.21 C81.1 77.79,24.11 R10.1
N$25
  Bottom 0.203: R6.1 53.02,24.43 C95.1 51.75,22.24 52.39,21.6 U27.7
N$26  (via drill 0.35)
  other vias: 38.42,41.59
N$27  (via drill 0.35)
  other vias: 40.32,44.77
N$28  (via drill 0.35)
  other vias: 30.8,45.09
N$29
  Bottom 0.203: C84.1 R24.1 40.02,74.35 40.28,74.61 U3.3 41.6,74.92 41.99,75.3 41.99,75.56 41.99,79.17 41.99,81.99 44.05,84.06 J5.1
N$30  (via drill 0.35)
  other vias: 32.38,41.59
N$31
  Bottom 0.203: R23.1 R22.2 40.64,80.01 41.27,79.38 41.27,79.36 41.63,79 41.63,76.48 41.37,76.22 U3.1
N$32  (via drill 0.35)
  other vias: 28.89,40.01
N$33  (via drill 0.35)
  other vias: 27.3,42.86
N$34
  Bottom 0.203: U23.1 47.32,76.22 47.66,76.56 47.66,79.02 46.67,80.01 R25.2 R28.1
N$35
  Bottom 0.203: C101.1 R34.1 52.09,74.35 52.34,74.61 U24.3 52.33,74.93 51.55,74.93 51.12,75.36 50.16,75.36 48.38,77.15 48.38,81.98 46.05,84.31 J5.5
N$36
  Bottom 0.203: U24.1 53.35,76.22 53.7,76.56 53.7,79.02 52.7,80.01 R32.2 R33.1
N$37  (via drill 0.35)
  Bottom 0.203: C98.1 R64.1 32.05,21.21 31.79,20.95 U30.3 31.77,20.67 30.48,20.67 29.84,20.04 29.84,15.24 32.7,12.38 45.6,12.38 46.55,11.43 J4.1 v46.55,9.17
N$38
  Bottom 0.203: C54.1 R40.1 72.13,49.2 72.39,48.94 U15.3 72.69,48.26 | 72.69,47.65 72.69,48.26 | 72.69,48.26 72.71,48.24 72.71,47.6 73.08,47.23 78.12,47.23 79.87,45.48 J3.1
N$39  (via drill 0.35)
  other vias: 36.83,53.98
N$40  (via drill 0.35)
  other vias: 33.97,53.98
N$41
  Bottom 0.203: U15.1 73.99,47.93 74.33,47.59 76.8,47.59 77.79,48.58 R38.2 R39.1
N$42  (via drill 0.35)
  other vias: 33.97,50.16
N$43  (via drill 0.35)
  other vias: 36.83,50.16
N$44
  Bottom 0.203: C70.1 R46.1 72.13,43.16 72.39,42.91 U19.3 72.69,41.59 73.08,41.2 78.6,41.2 81.86,44.45 82.54,44.45 J3.3
N$45
  Bottom 0.203: U19.1 73.99,41.9 74.33,41.55 76.78,41.55 77.3,42.07 77.31,42.07 | R45.1 R44.2 77.79,42.55 77.31,42.07 | 77.11,41.87 77.31,42.07
N$46
  Bottom 0.203: C71.1 R52.1 72.13,37.13 72.39,36.87 U21.3 72.69,37.66 73.14,38.1 73.14,38.87 75.11,40.84 78.94,40.84 81.58,43.48 J3.5
N$47
  Bottom 0.203: U21.1 73.99,35.86 74.33,35.52 76.8,35.52 77.79,36.51 R50.2 R51.1
N$48
  Bottom 0.203: LED1.A 23.59,4.96 R11.1
N$49
  Bottom 0.203: C105.1 R55.1 18.36,38.43 18.1,38.69 U26.3 17.8,40.01 17.78,40.02 17.78,40.03 17.41,40.4 12.06,40.4 9.49,42.98 J2.1
N$50  (1 unrouted)
N$51  (1 unrouted)
N$52  (1 unrouted)
N$53  (1 unrouted)
N$54
  Bottom 0.203: U26.1 16.5,39.7 16.15,40.05 13.69,40.05 12.7,39.05 R53.2 R54.1
N$55
  Bottom 0.203: C110.1 R58.1 18.36,44.47 18.1,44.73 U28.3 17.8,46.05 17.41,46.43 17.15,46.43 17.14,46.43 11.98,46.43 9.53,43.98 J2.3
N$56
  Bottom 0.203: U28.1 16.5,45.73 16.15,46.08 13.69,46.08 12.7,45.09 R56.2 R57.1
N$57
  Bottom 0.203: C111.1 R61.1 18.36,50.5 18.1,50.76 U29.3 17.78,50.74 17.78,49.96 17.35,49.53 17.35,48.76 15.38,46.79 11.33,46.79 9.53,44.98 J2.5
N$58
  Bottom 0.203: U29.1 16.5,51.77 16.15,52.11 13.69,52.11 12.7,51.12 R59.2 R60.1
N$61
  Bottom 0.203: U30.1 30.78,19.35 30.44,19.01 30.44,16.55 31.43,15.56 R62.2 R63.1
N$63
  Bottom 0.203: C115.1 R67.1 26.02,21.21 25.76,20.95 U31.3 24.44,20.65 23.93,20.14 23.93,15.18 27.08,12.03 44.49,12.03 45.55,10.96 J4.3
N$64
  Bottom 0.203: U31.1 24.75,19.35 24.29,18.89 24.29,16.67 25.4,15.56 R65.2 R66.1
N$65
  Bottom 0.203: C116.1 R70.1 19.99,21.21 19.73,20.95 U32.3 20.51,20.65 20.96,20.21 21.73,20.21 23.58,18.36 23.58,15.03 26.94,11.67 44.21,11.67 44.55,11.32 J4.5
N$66
  Bottom 0.203: R69.1 R68.2 19.35,16.2 18.75,16.2 18.38,16.57 18.38,19 18.73,19.35 U32.1
TEMP
  Bottom 0.203: R2.2 TP1.1 58.72,31.43 65.72,24.43 U2.2
UCB0_SPI_CLK  (via drill 0.35)  (5 unrouted)
  Top 0.203: 56.46,13.02 v56.83,13.02
  Bottom 0.203: U25.16 v56.83,13.02 | U13.16 v81.6,13.02 | v73.34,13.02 U1.16 | U27.16 48.58,13.1 v48.54,13.06
UCB0_SPI_MISO  (via drill 0.35)  (5 unrouted)
  Bottom 0.203: v75.88,12.7 U1.12
UCB0_SPI_MOSI  (2 unrouted)
  Bottom 0.203: U13.14 82.87,13.39 80.27,10.79 74.3,10.79 | U1.14 74.61,12.7 74.3,12.38 74.3,10.79 | U25.14 58.1,10.79 | 58.1,10.79 74.3,10.79 | U27.14 49.85,11.75 50.8,10.79 58.1,10.79
X+_0_DEGREES  (1 unrouted)
  Bottom 0.203: U26.4 18.1,36.87 18.36,37.13 R55.2 C105.2 20.32,35.56 27.46,28.42 54.45,28.42 58.1,24.77 U25.3
X+_120_DEGREES  (1 unrouted)
  Bottom 0.203: U28.4 18.1,42.91 18.36,43.16 R58.2 C110.2 20.32,41.27 21.59,40.01 21.59,35.56 28.38,28.77 54.6,28.77 58.74,24.63 U25.4
X+_240_DEGREES  (1 unrouted)
  Bottom 0.203: U29.4 18.1,48.94 18.36,49.2 R61.2 C111.2 | C111.2 20.34,49.21 20.95,49.21 | U25.5 59.37,20.95 59.17,21.16 59.17,24.7 54.75,29.13 28.66,29.13 21.95,35.84 21.95,45.36 20.32,46.99 C111.2
X-_0_DEGREES
  Bottom 0.203: 68.9,47.31 TP10.1 | TP10.1 68.9,49.85 69.53,50.48 69.53,50.5 C54.2 R40.2 72.13,50.5 72.39,50.76 U15.4 | U13.3 82.87,24.13 78.5,28.5 76,28.5 67.14,37.36 67.14,43.14 68.9,44.89 TP10.1
X-_120_DEGREES
  Bottom 0.203: U19.4 72.39,44.73 72.13,44.47 R46.2 C70.2 69.23,44.47 68.58,43.81 TP11.1 67.5,42.42 67.5,37.5 76.15,28.85 78.65,28.85 83.5,24 U13.4
X-_240_DEGREES
  Bottom 0.203: U21.4 72.39,38.69 72.13,38.43 R52.2 C71.2 | C71.2 69.23,38.43 TP12.1 68.58,36.93 76.3,29.21 78.79,29.21 84.07,23.93 84.07,21.66 84.14,21.59 U13.5 | C71.2 70.17,38.29
Y+_0_DEGREES  (1 unrouted)
  Bottom 0.203: U30.4 33.61,20.95 33.35,21.21 R64.2 C98.2 33.67,22.86 49.53,22.86 49.85,22.54 U27.3
Y+_120_DEGREES  (1 unrouted)
  Top 0.203: 34.59,27.29 TP19.1
  Bottom 0.203: U31.4 27.58,20.95 27.32,21.21 R67.2 27.32,22.86 | 27.32,22.86 C115.2 30.89,23.18 31.6,23.88 49.01,23.88 50.33,22.56 50.33,19.85 U27.4 | 27.3,22.88 27.32,22.86
Y+_240_DEGREES  (1 unrouted)
  Bottom 0.203: U32.4 21.55,20.95 21.29,21.21 R70.2 C116.2 24.86,23.18 25.92,24.24 49.16,24.24 51.12,22.28 U27.5
Y-_0_DEGREES
  Bottom 0.203: U3.4 38.46,74.61 38.72,74.35 R24.2 C84.2 38.72,70.5 TP5.1 53.66,55.56 57.92,55.56 65.89,47.59 65.89,36.46 74.61,27.74 U1.3
Y-_120_DEGREES
  Bottom 0.203: U23.4 44.49,74.61 44.75,74.35 R31.2 C100.2 44.75,70.5 TP7.1 66.25,49.01 66.25,36.61 75.25,27.61 U1.4
Y-_240_DEGREES
  Bottom 0.152: 66.6,36.83 66.6,36.76
  Bottom 0.203: U24.4 50.52,74.61 50.78,74.35 R34.2 C101.2 50.78,70.5 TP9.1 66.6,54.68 66.6,36.83 | U1.5 75.88,21.59 75.81,21.66 75.81,27.55 66.6,36.76

### Text on the board
tPlace: Z MINUS SUN SENSE BOARD - REV A | LORIS CubeSat ADCS Subsystem | Designed by: T. Christison | TOP SIDE
bPlace: Z MINUS SUN SENSE BOARD - REV A | LORIS CubeSat ADCS Subsystem | Designed by: T. Christison | BOTTOM SIDE | +3V3 | GND
bNames: U8 | U15 | U6 | U23 | U24 | U6 | U19 | U9 | U21 | U29 | C72 | U28 | C90 | U26 | U32 | U31 | U30